# EAGLE design Rover_PCB_2019-02-01 (EAGLE 7.7.0)

## Sheet 1 of 10
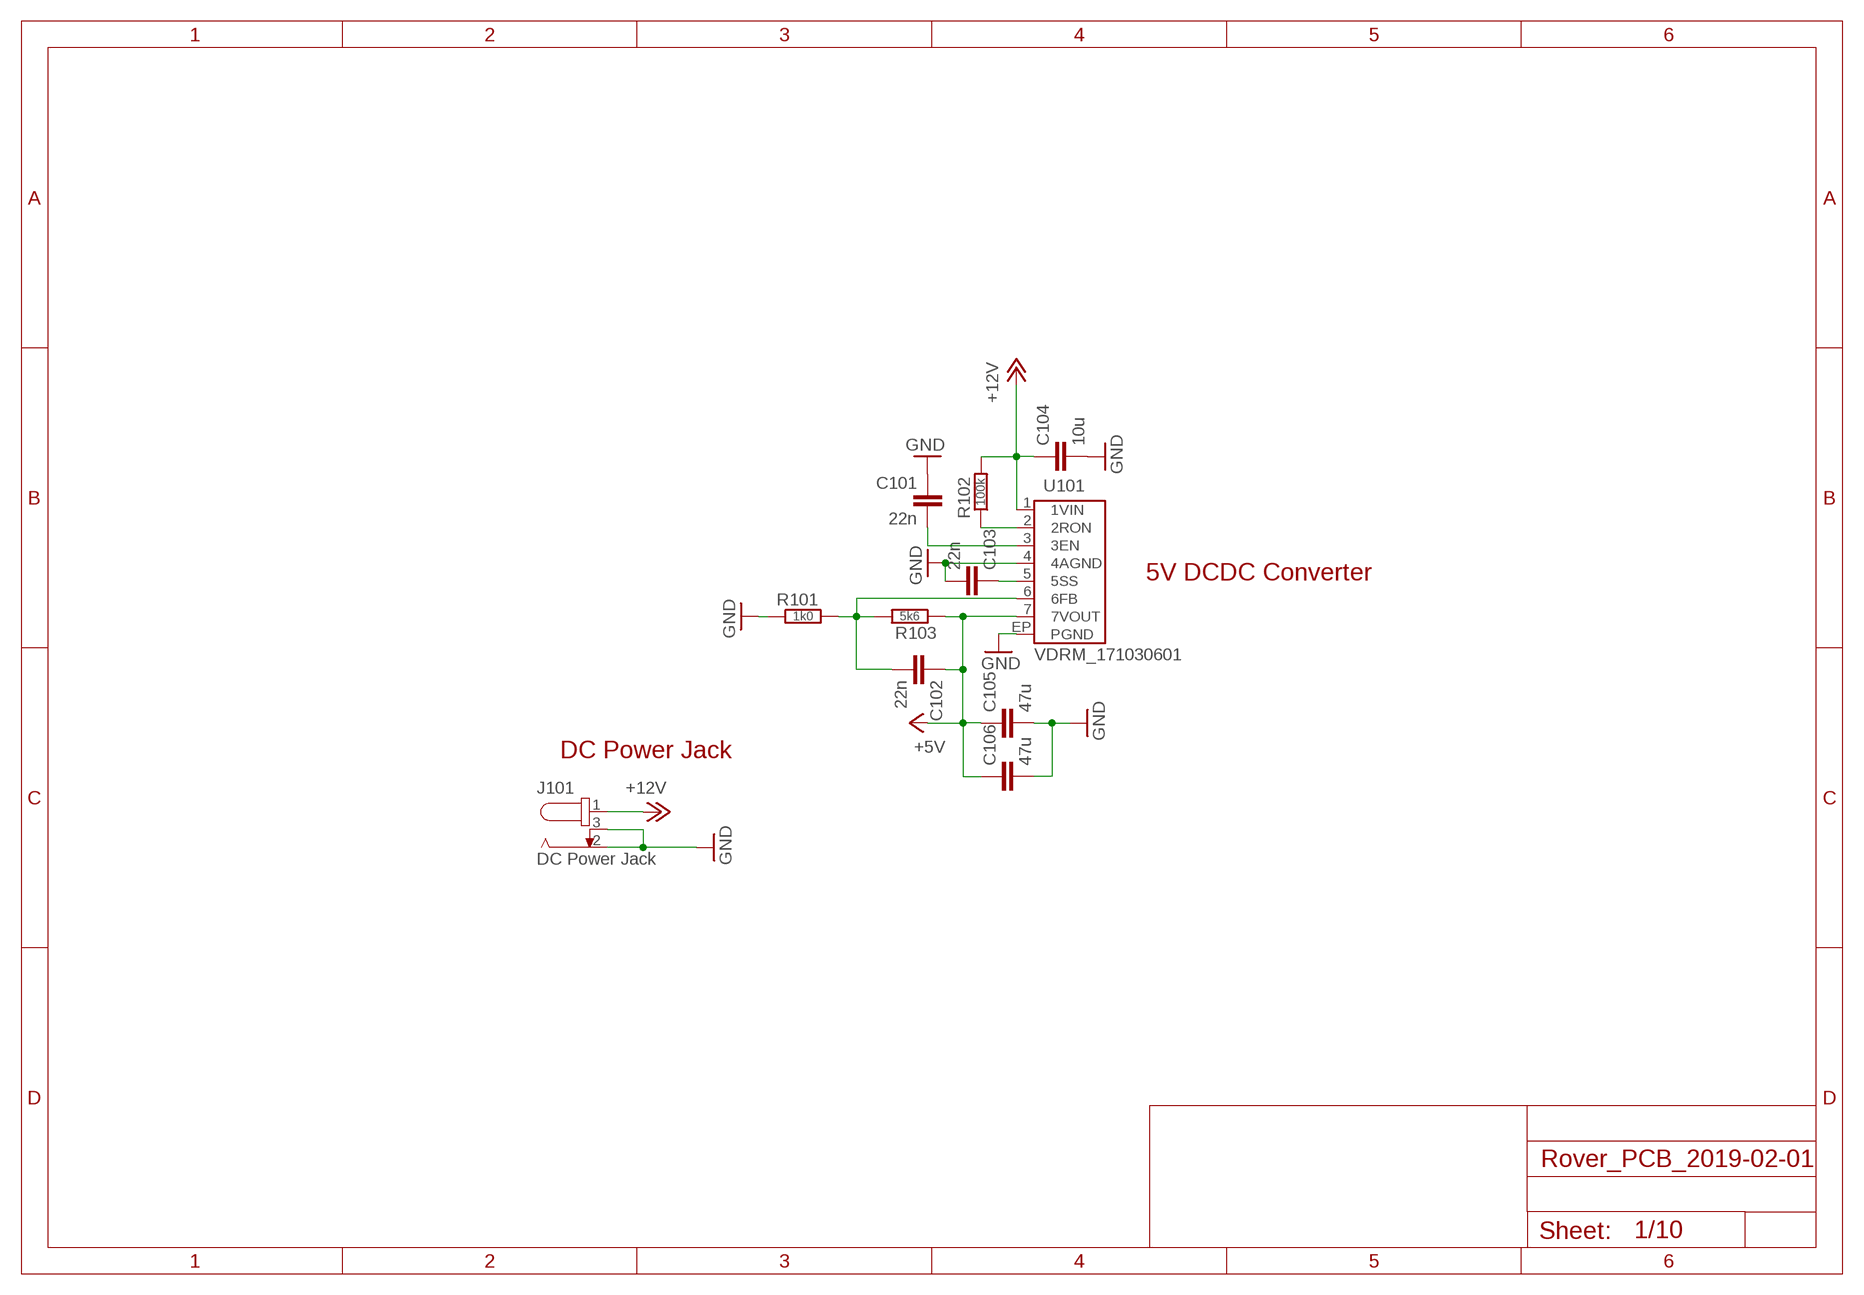
[diagram p0: schematic, sheet 1]

### Parts
C101  22n  C-EUC0805N  [CAPC2012X95N]
C102  22n  C-EUC0805N  [CAPC2012X95N]
C103  22n  C-EUC0805N  [CAPC2012X95N]
C104  10u  C-EUC1210N  [CAP-US1210-EU3225]
C105  47u  C-EUC1210N  [CAP-US1210-EU3225]
C106  47u  C-EUC1210N  [CAP-US1210-EU3225]
J101  DC Power Jack  694108105102  [69410X105102]
R101  1k0  R-EU-R0805N  [RESC2012X50N]
R102  100k  R-EU-R0805N  [RESC2012X50N]
R103  5k6  R-EU-R0805N  [RESC2012X50N]
U101  VDRM_171030601  [VDRM_7PIN-PFM]

### Nets
+5V: C102.1 C105.1 C106.1 R103.1 U101.7(7VOUT) ; also sheet 2,3,4,6
+12V: C104.1 J101.1 R102.2 U101.1(1VIN) ; also sheet 8,9
GND: C101.1 C103.2 C104.2 C105.2 C106.2 J101.2 J101.3 R101.1 U101.4(4AGND) U101.EP(PGND) ; also sheet 2,3,4,5,6,7,8,9,10
N$1: R102.1 U101.2(2RON)
N$2: C103.1 U101.5(5SS)
N$7: C102.2 R101.2 R103.2 U101.6(6FB)
N$9: C101.2 U101.3(3EN)

### Notes on the sheet
- 5V DCDC Converter
- DC Power Jack

## Sheet 2 of 10
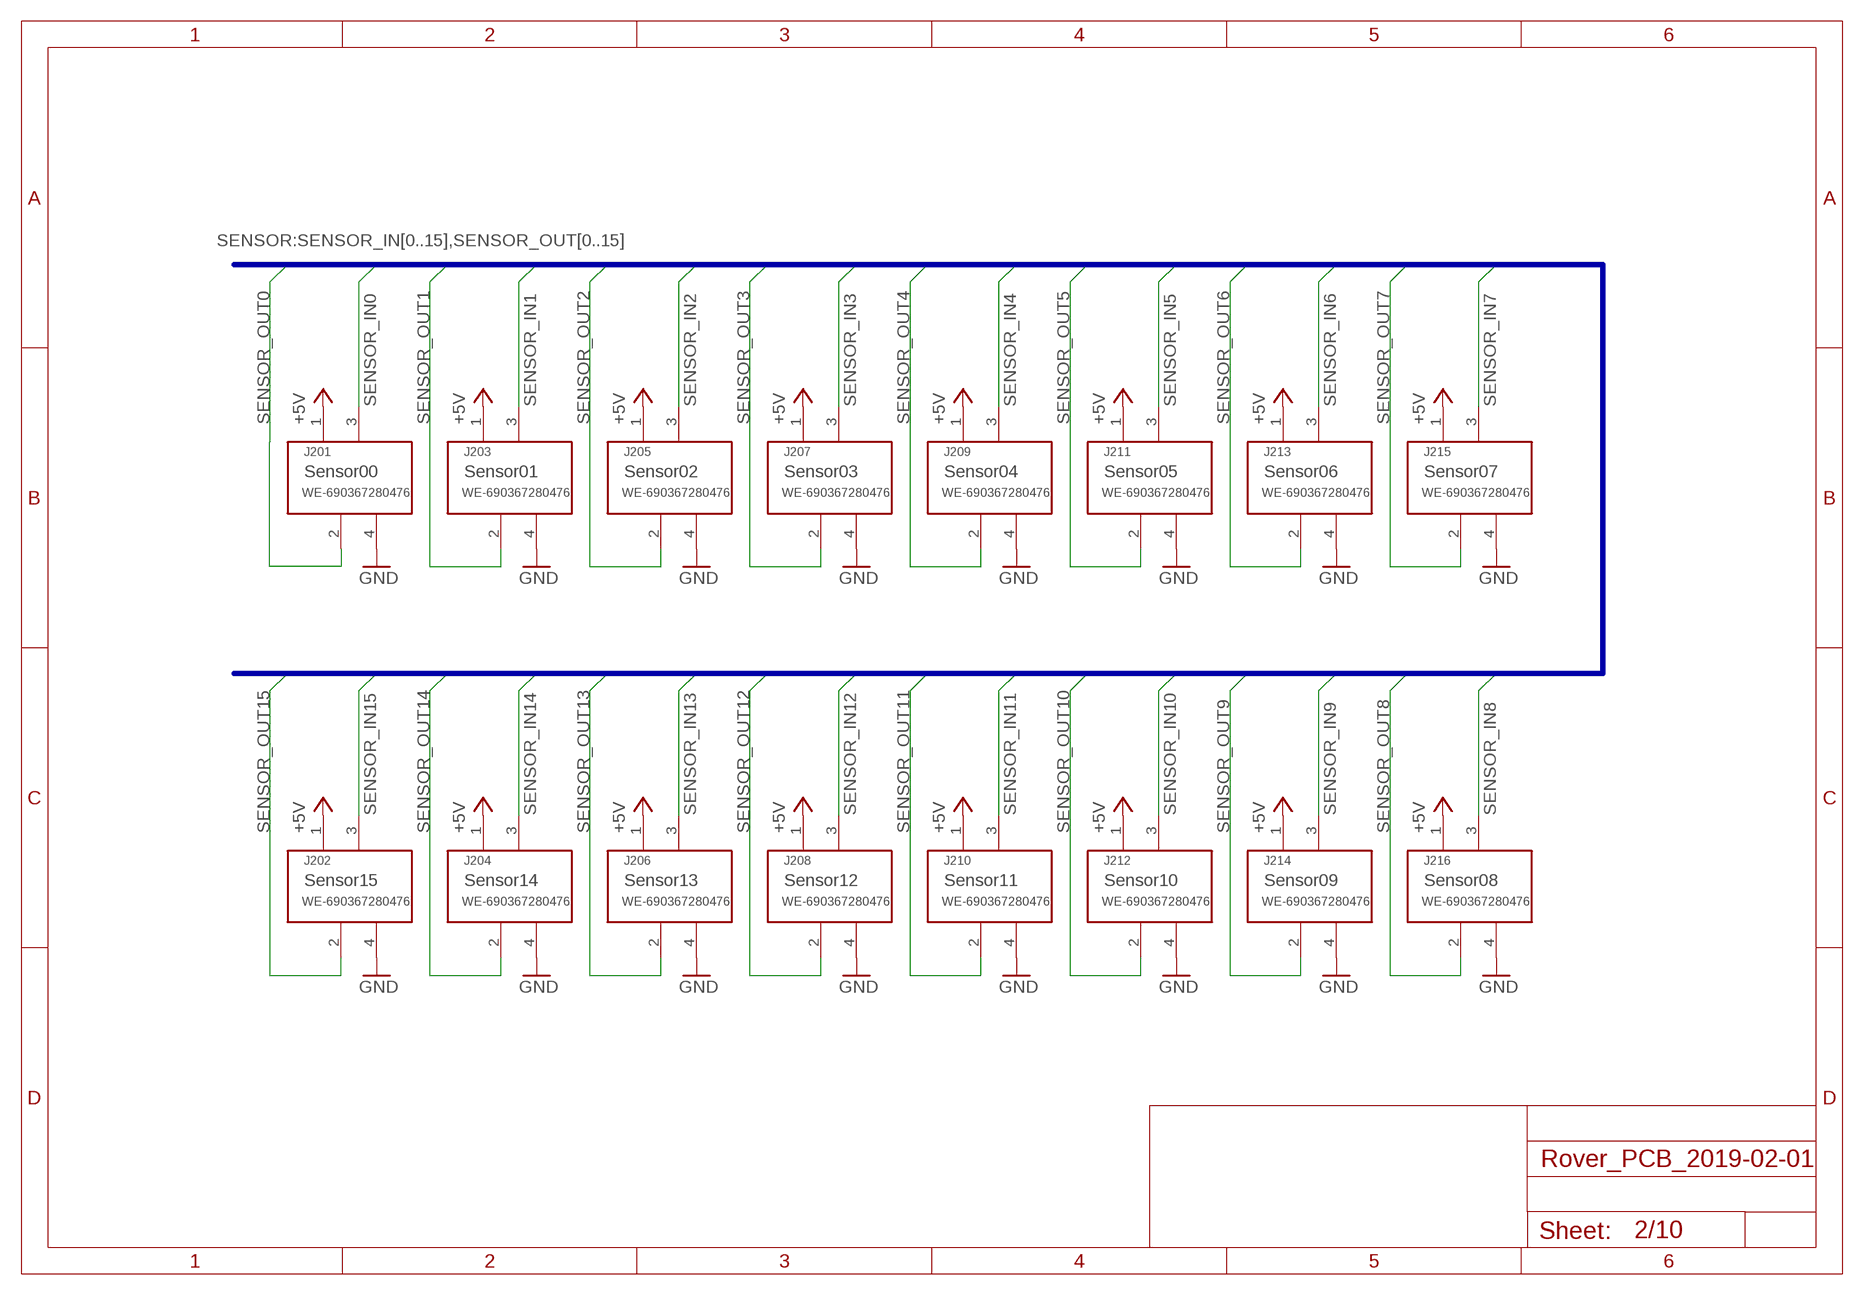
[diagram p1: schematic, sheet 2]

### Parts
J201  WE-690367280476  690367280476  [690367280476]
J202  WE-690367280476  690367280476  [690367280476]
J203  WE-690367280476  690367280476  [690367280476]
J204  WE-690367280476  690367280476  [690367280476]
J205  WE-690367280476  690367280476  [690367280476]
J206  WE-690367280476  690367280476  [690367280476]
J207  WE-690367280476  690367280476  [690367280476]
J208  WE-690367280476  690367280476  [690367280476]
J209  WE-690367280476  690367280476  [690367280476]
J210  WE-690367280476  690367280476  [690367280476]
J211  WE-690367280476  690367280476  [690367280476]
J212  WE-690367280476  690367280476  [690367280476]
J213  WE-690367280476  690367280476  [690367280476]
J214  WE-690367280476  690367280476  [690367280476]
J215  WE-690367280476  690367280476  [690367280476]
J216  WE-690367280476  690367280476  [690367280476]

### Nets
+5V: J201.1 J202.1 J203.1 J204.1 J205.1 J206.1 J207.1 J208.1 J209.1 J210.1 J211.1 J212.1 J213.1 J214.1 J215.1 J216.1 ; also sheet 1,3,4,6
GND: J201.4 J202.4 J203.4 J204.4 J205.4 J206.4 J207.4 J208.4 J209.4 J210.4 J211.4 J212.4 J213.4 J214.4 J215.4 J216.4 ; also sheet 1,3,4,5,6,7,8,9,10
SENSOR_IN0: J201.3 ; also sheet 3
SENSOR_IN1: J203.3 ; also sheet 3
SENSOR_IN2: J205.3 ; also sheet 3
SENSOR_IN3: J207.3 ; also sheet 3
SENSOR_IN4: J209.3 ; also sheet 3
SENSOR_IN5: J211.3 ; also sheet 3
SENSOR_IN6: J213.3 ; also sheet 3
SENSOR_IN7: J215.3 ; also sheet 3
SENSOR_IN8: J216.3 ; also sheet 3
SENSOR_IN9: J214.3 ; also sheet 3
SENSOR_IN10: J212.3 ; also sheet 3
SENSOR_IN11: J210.3 ; also sheet 3
SENSOR_IN12: J208.3 ; also sheet 3
SENSOR_IN13: J206.3 ; also sheet 3
SENSOR_IN14: J204.3 ; also sheet 3
SENSOR_IN15: J202.3 ; also sheet 3
SENSOR_OUT0: J201.2 ; also sheet 3
SENSOR_OUT1: J203.2 ; also sheet 3
SENSOR_OUT2: J205.2 ; also sheet 3
SENSOR_OUT3: J207.2 ; also sheet 3
SENSOR_OUT4: J209.2 ; also sheet 3
SENSOR_OUT5: J211.2 ; also sheet 3
SENSOR_OUT6: J213.2 ; also sheet 3
SENSOR_OUT7: J215.2 ; also sheet 3
SENSOR_OUT8: J216.2 ; also sheet 3
SENSOR_OUT9: J214.2 ; also sheet 3
SENSOR_OUT10: J212.2 ; also sheet 3
SENSOR_OUT11: J210.2 ; also sheet 3
SENSOR_OUT12: J208.2 ; also sheet 3
SENSOR_OUT13: J206.2 ; also sheet 3
SENSOR_OUT14: J204.2 ; also sheet 3
SENSOR_OUT15: J202.2 ; also sheet 3

### Buses
SENSOR:SENSOR_IN[0..15],SENSOR_OUT[0..15]

## Sheet 3 of 10
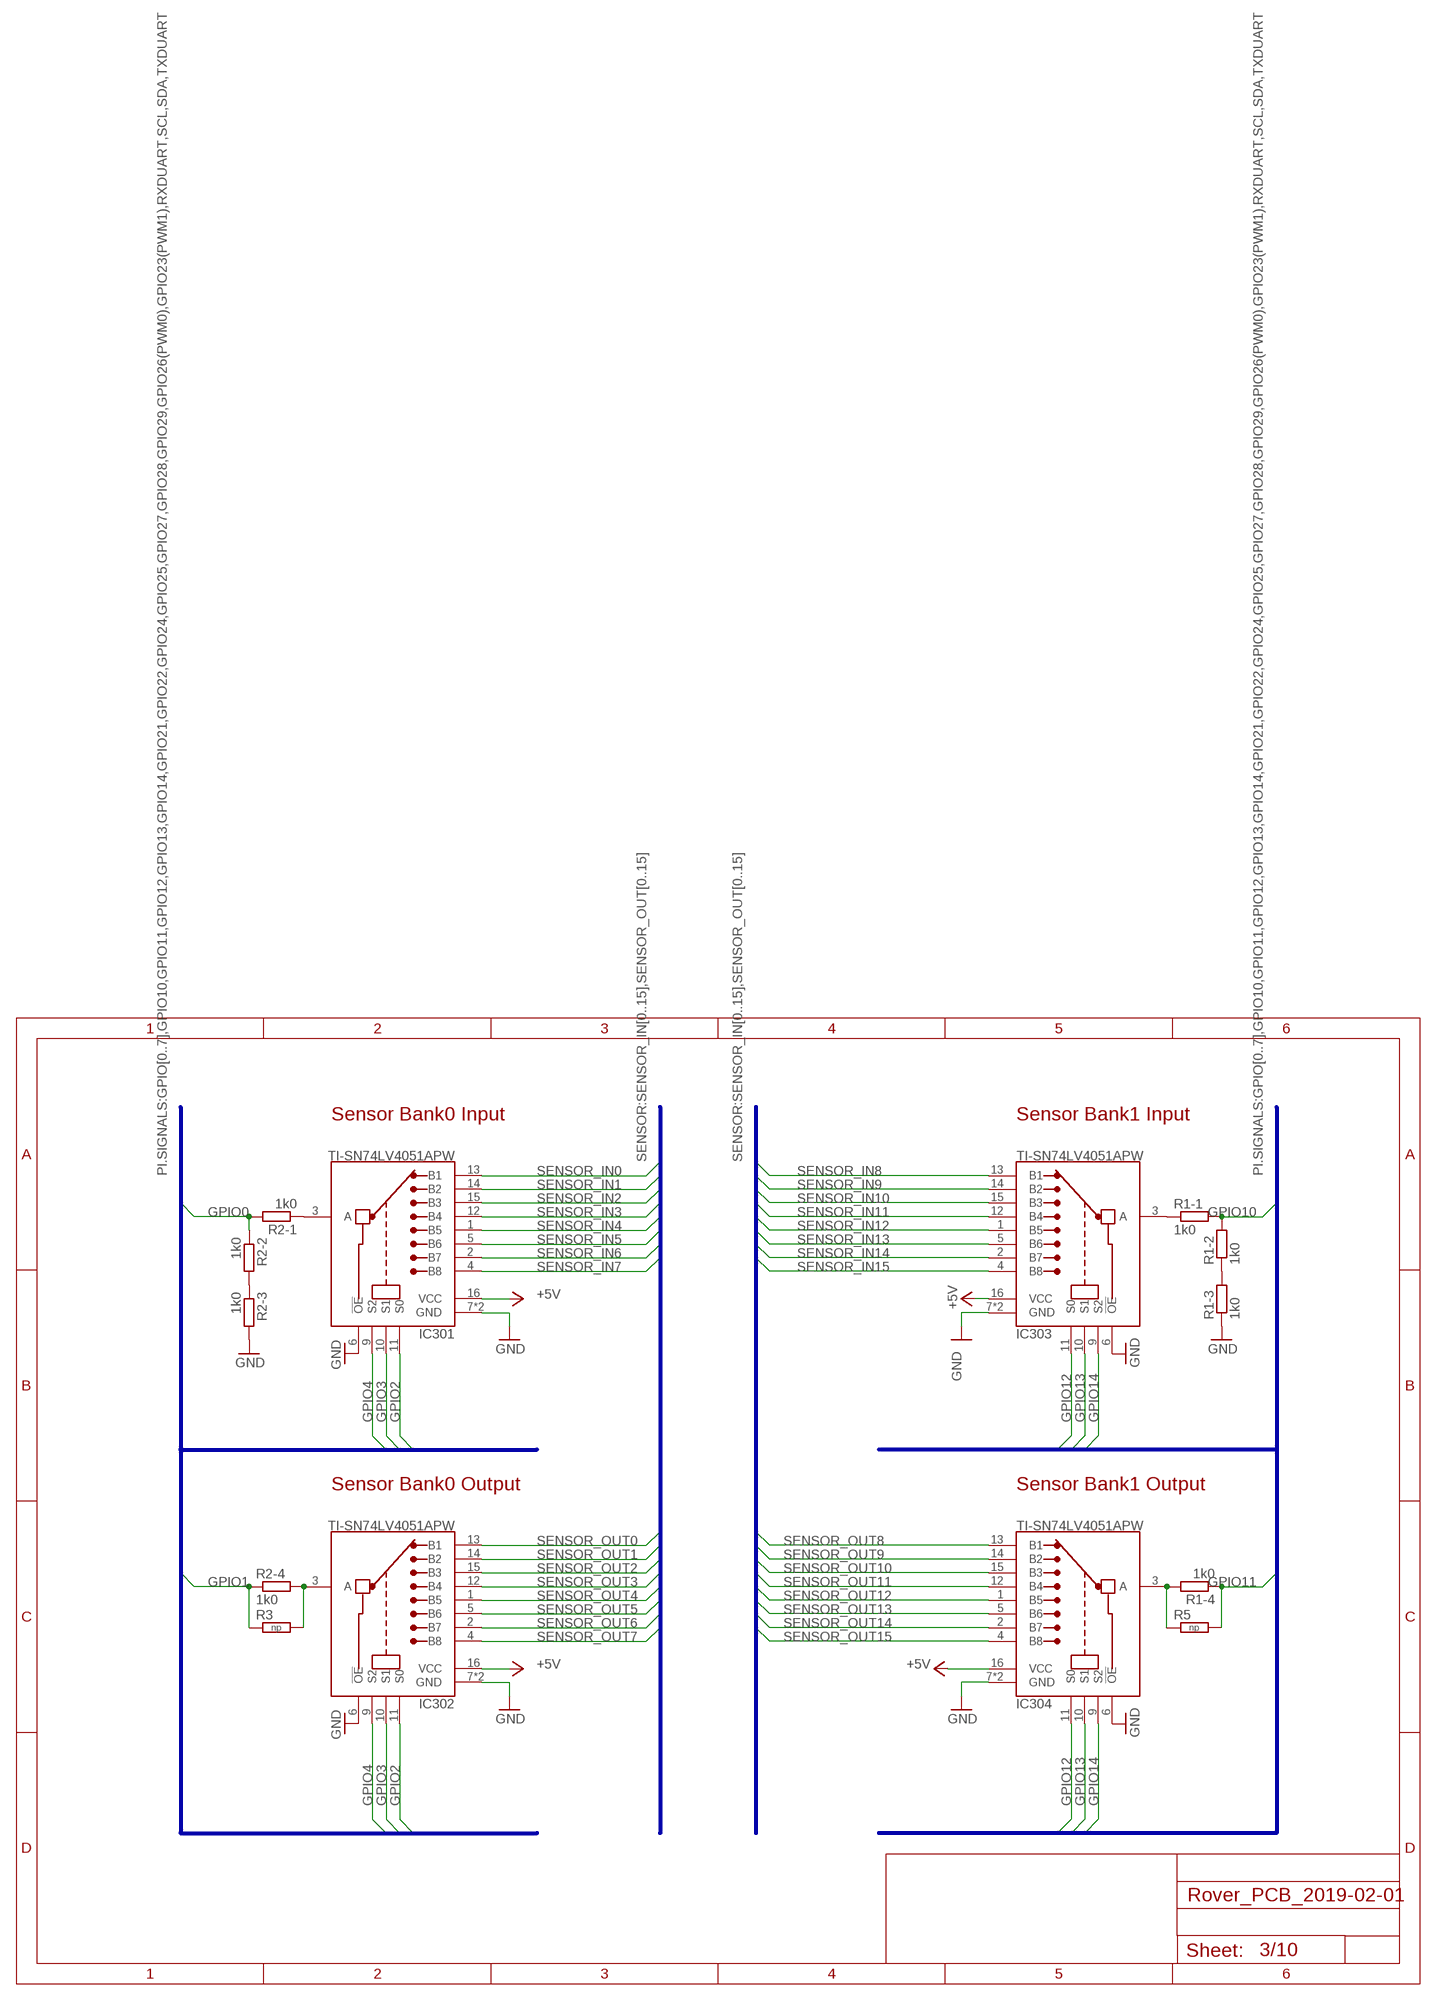
[diagram p2: schematic, sheet 3]

### Parts
IC301  TI-SN74LV4051APW  [SOP16P65_500X640X120L62X24L]
IC302  TI-SN74LV4051APW  [SOP16P65_500X640X120L62X24L]
IC303  TI-SN74LV4051APW  [SOP16P65_500X640X120L62X24L]
IC304  TI-SN74LV4051APW  [SOP16P65_500X640X120L62X24L]
R1  1k0  CTS-74,2C083  [CAPCAF80P160X320X70-8L]
R2  1k0  CTS-74,2C083  [CAPCAF80P160X320X70-8L]
R3  np  R-EU-R0805N  [RESC2012X50N]
R5  np  R-EU-R0805N  [RESC2012X50N]

### Nets
+5V: IC301.16(VCC) IC302.16(VCC) IC303.16(VCC) IC304.16(VCC) ; also sheet 1,2,4,6
GND: IC301.6(!OE) IC301.7(GND) IC301.8(GND) IC302.6(!OE) IC302.7(GND) IC302.8(GND) IC303.6(!OE) IC303.7(GND) IC303.8(GND) IC304.6(!OE) IC304.7(GND) IC304.8(GND) R1.3 R2.6 ; also sheet 1,2,4,5,6,7,8,9,10
GPIO0: R2.2 R2.8 ; also sheet 4
GPIO1: R2.4 R3.1 ; also sheet 4
GPIO2: IC301.11(S0) IC302.11(S0) ; also sheet 4
GPIO3: IC301.10(S1) IC302.10(S1) ; also sheet 4
GPIO4: IC301.9(S2) IC302.9(S2) ; also sheet 4
GPIO10: R1.7 R1.8 ; also sheet 4
GPIO11: R1.4 R5.2 ; also sheet 4
GPIO12: IC303.11(S0) IC304.11(S0) ; also sheet 4
GPIO13: IC303.10(S1) IC304.10(S1) ; also sheet 4
GPIO14: IC303.9(S2) IC304.9(S2) ; also sheet 4
N$8: R1.2 R1.6
N$75: IC302.3(A) R2.5 R3.2
N$76: IC304.3(A) R1.5 R5.1
N$79: R2.3 R2.7
N$80: IC301.3(A) R2.1
N$81: IC303.3(A) R1.1
SENSOR_IN0: IC301.13(B1) ; also sheet 2
SENSOR_IN1: IC301.14(B2) ; also sheet 2
SENSOR_IN2: IC301.15(B3) ; also sheet 2
SENSOR_IN3: IC301.12(B4) ; also sheet 2
SENSOR_IN4: IC301.1(B5) ; also sheet 2
SENSOR_IN5: IC301.5(B6) ; also sheet 2
SENSOR_IN6: IC301.2(B7) ; also sheet 2
SENSOR_IN7: IC301.4(B8) ; also sheet 2
SENSOR_IN8: IC303.13(B1) ; also sheet 2
SENSOR_IN9: IC303.14(B2) ; also sheet 2
SENSOR_IN10: IC303.15(B3) ; also sheet 2
SENSOR_IN11: IC303.12(B4) ; also sheet 2
SENSOR_IN12: IC303.1(B5) ; also sheet 2
SENSOR_IN13: IC303.5(B6) ; also sheet 2
SENSOR_IN14: IC303.2(B7) ; also sheet 2
SENSOR_IN15: IC303.4(B8) ; also sheet 2
SENSOR_OUT0: IC302.13(B1) ; also sheet 2
SENSOR_OUT1: IC302.14(B2) ; also sheet 2
SENSOR_OUT2: IC302.15(B3) ; also sheet 2
SENSOR_OUT3: IC302.12(B4) ; also sheet 2
SENSOR_OUT4: IC302.1(B5) ; also sheet 2
SENSOR_OUT5: IC302.5(B6) ; also sheet 2
SENSOR_OUT6: IC302.2(B7) ; also sheet 2
SENSOR_OUT7: IC302.4(B8) ; also sheet 2
SENSOR_OUT8: IC304.13(B1) ; also sheet 2
SENSOR_OUT9: IC304.14(B2) ; also sheet 2
SENSOR_OUT10: IC304.15(B3) ; also sheet 2
SENSOR_OUT11: IC304.12(B4) ; also sheet 2
SENSOR_OUT12: IC304.1(B5) ; also sheet 2
SENSOR_OUT13: IC304.5(B6) ; also sheet 2
SENSOR_OUT14: IC304.2(B7) ; also sheet 2
SENSOR_OUT15: IC304.4(B8) ; also sheet 2

### Buses
PI.SIGNALS:GPIO[0..7],GPIO10,GPIO11,GPIO12,GPIO13,GPIO14,GPIO21,GPIO22,GPIO24,GPIO25,GPIO27,GPIO28,GPIO29,GPIO26(PWM0),GPIO23(PWM1),RXDUART,SCL,SDA,TXDUART
SENSOR:SENSOR_IN[0..15],SENSOR_OUT[0..15]

### Notes on the sheet
- Sensor Bank0 Input | Sensor Bank1 Input
- Sensor Bank0 Output | Sensor Bank1 Output

## Sheet 4 of 10
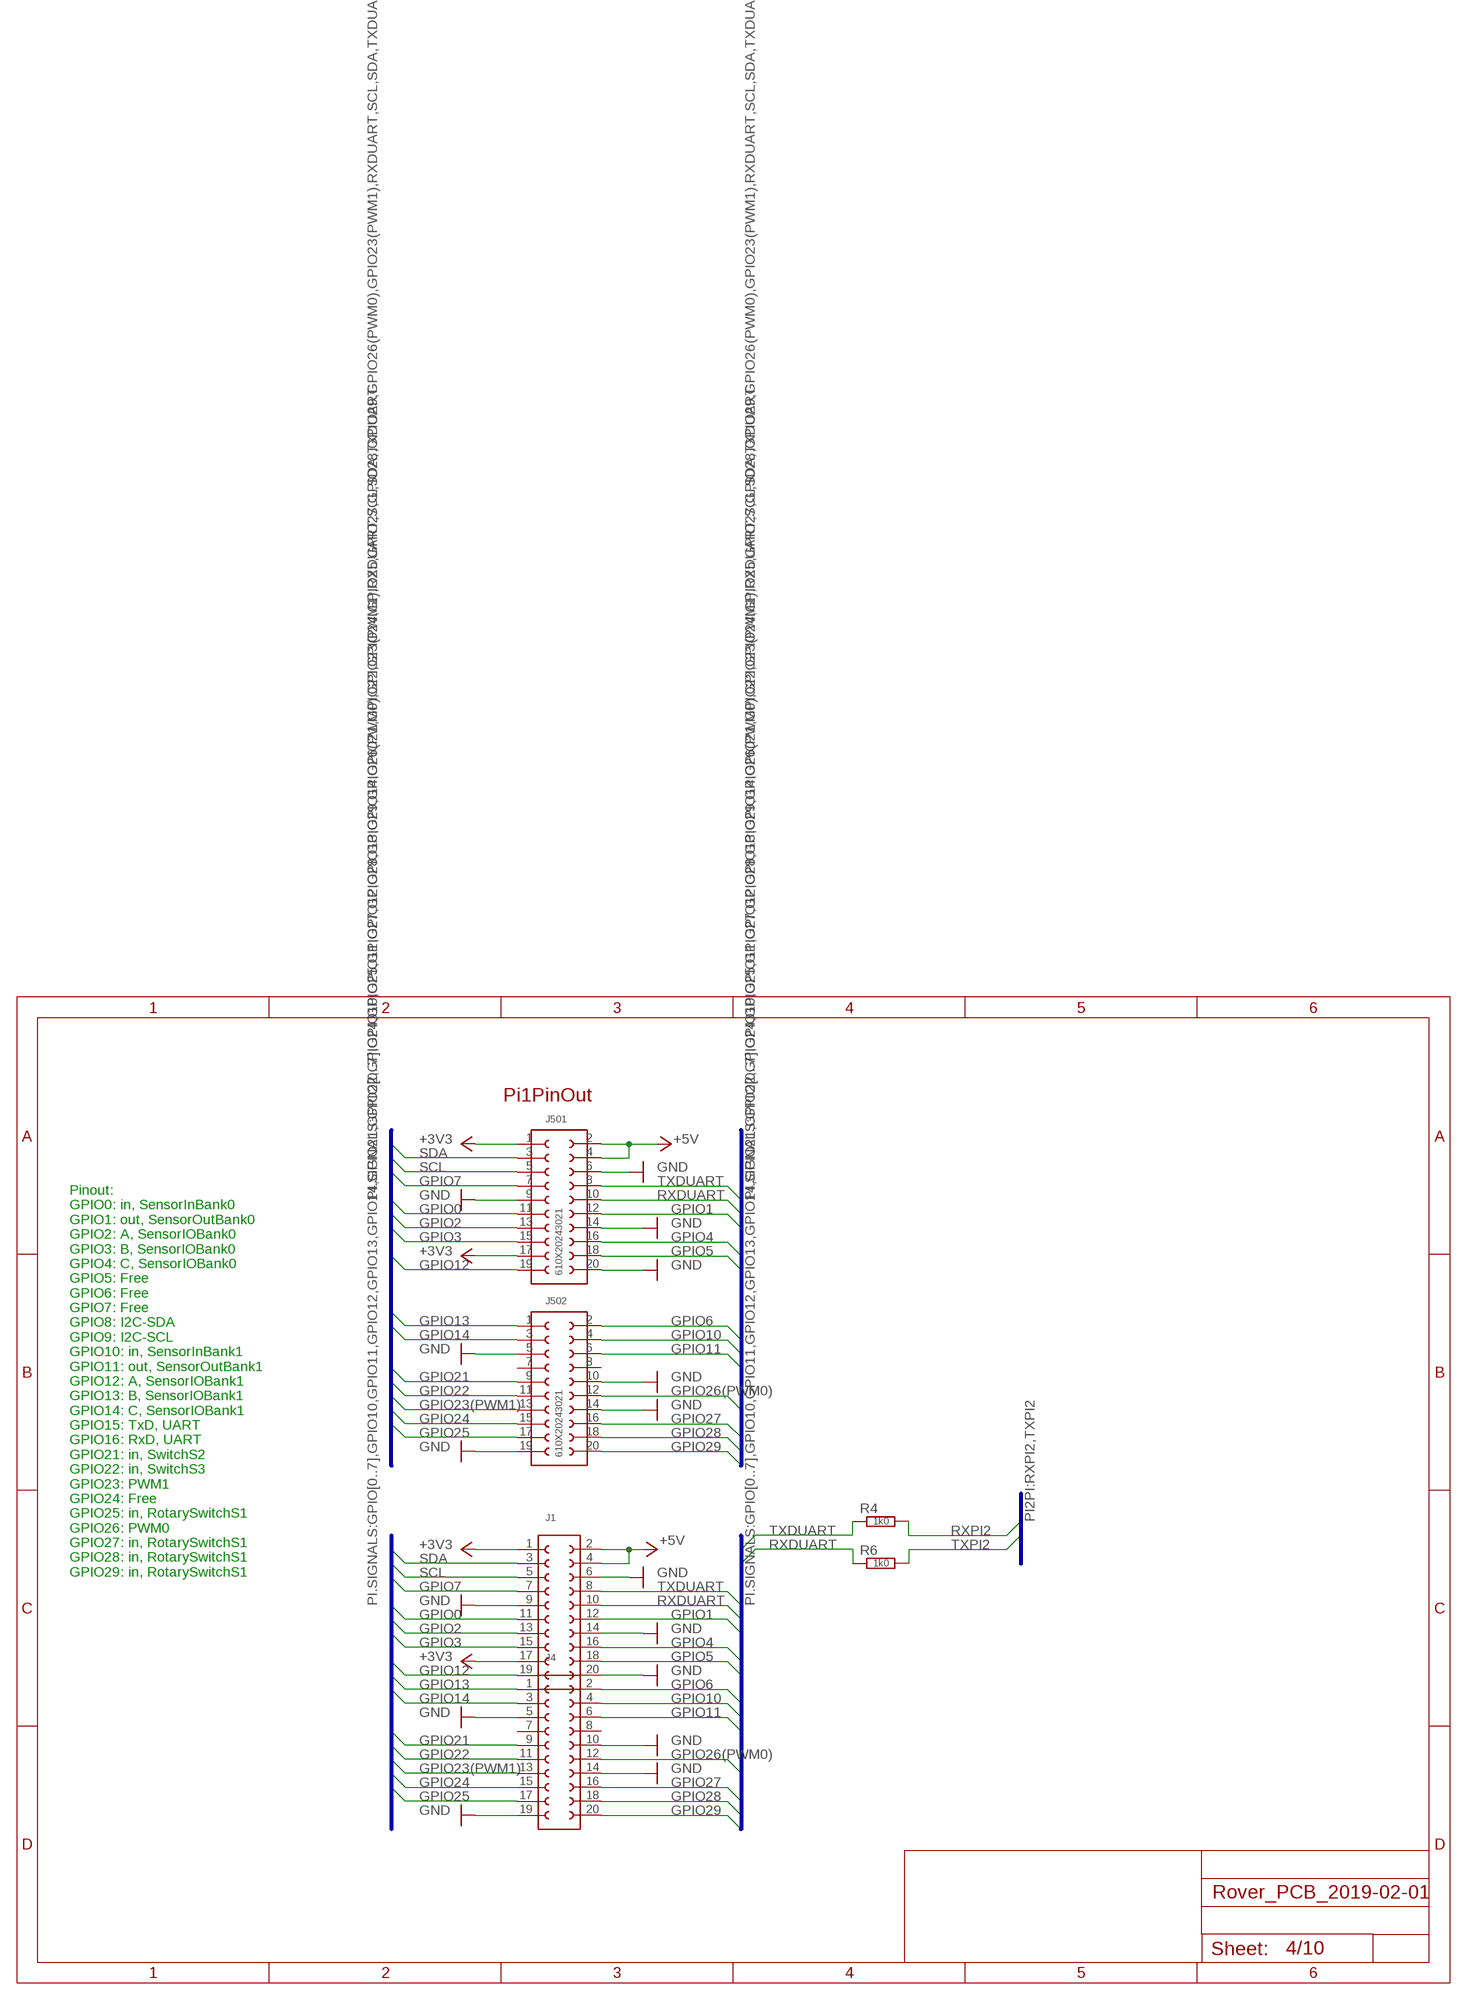
[diagram p3: schematic, sheet 4]

### Parts
J1  610X2021121  [610X2021121]
J4  610X2021121  [610X2021121]
J501  610X20243021  [610X20243021]
J502  610X20243021  [610X20243021]
R4  1k0  R-EU-R0805N  [RESC2012X50N]
R6  1k0  R-EU-R0805N  [RESC2012X50N]

### Nets
+3V3: J1.1 J1.17 J501.1 J501.17 ; also sheet 5,7,8,9,10
+5V: J1.2 J1.4 J501.2 J501.4 ; also sheet 1,2,3,6
GND: J1.6 J1.9 J1.14 J1.20 J4.5 J4.10 J4.14 J4.19 J501.6 J501.9 J501.14 J501.20 J502.5 J502.10 J502.14 J502.19 ; also sheet 1,2,3,5,6,7,8,9,10
GPIO0: J1.11 J501.11 ; also sheet 3
GPIO1: J1.12 J501.12 ; also sheet 3
GPIO2: J1.13 J501.13 ; also sheet 3
GPIO3: J1.15 J501.15 ; also sheet 3
GPIO4: J1.16 J501.16 ; also sheet 3
GPIO5: J1.18 J501.18
GPIO6: J4.2 J502.2
GPIO7: J1.7 J501.7
GPIO10: J4.4 J502.4 ; also sheet 3
GPIO11: J4.6 J502.6 ; also sheet 3
GPIO12: J1.19 J501.19 ; also sheet 3
GPIO13: J4.1 J502.1 ; also sheet 3
GPIO14: J4.3 J502.3 ; also sheet 3
GPIO21: J4.9 J502.9 ; also sheet 10
GPIO22: J4.11 J502.11 ; also sheet 10
GPIO23(PWM1): J4.13 J502.13 ; also sheet 7
GPIO24: J4.15 J502.15
GPIO25: J4.17 J502.17 ; also sheet 10
GPIO26(PWM0): J4.12 J502.12 ; also sheet 7
GPIO27: J4.16 J502.16 ; also sheet 10
GPIO28: J4.18 J502.18 ; also sheet 10
GPIO29: J4.20 J502.20 ; also sheet 10
RXDUART: J1.10 J501.10 R6.1
RXPI2: R4.2 ; also sheet 6
SCL: J1.5 J501.5 ; also sheet 5,7
SDA: J1.3 J501.3 ; also sheet 5,7
TXDUART: J1.8 J501.8 R4.1
TXPI2: R6.2 ; also sheet 6
Unconnected: J4.7 J4.8 J502.7 J502.8

### Buses
PI.SIGNALS:GPIO[0..7],GPIO10,GPIO11,GPIO12,GPIO13,GPIO14,GPIO21,GPIO22,GPIO24,GPIO25,GPIO27,GPIO28,GPIO29,GPIO26(PWM0),GPIO23(PWM1),RXDUART,SCL,SDA,TXDUART
PI2PI:RXPI2,TXPI2

### Notes on the sheet
- Pi1PinOut
- Pinout:
  GPIO0: in, SensorInBank0
  GPIO1: out, SensorOutBank0
  GPIO2: A, SensorIOBank0
  GPIO3: B, SensorIOBank0
  GPIO4: C, SensorIOBank0
  GPIO5: Free
  GPIO6: Free
  GPIO7: Free
  GPIO8: I2C-SDA
  GPIO9: I2C-SCL
  GPIO10: in, SensorInBank1
  GPIO11: out, SensorOutBank1
  GPIO12: A, SensorIOBank1
  GPIO13: B, SensorIOBank1
  GPIO14: C, SensorIOBank1
  GPIO15: TxD, UART
  GPIO16: RxD, UART
  GPIO21: in, SwitchS2
  GPIO22: in, SwitchS3
  GPIO23: PWM1
  GPIO24: Free
  GPIO25: in, RotarySwitchS1
  GPIO26: PWM0
  GPIO27: in, RotarySwitchS1
  GPIO28: in, RotarySwitchS1
  GPIO29: in, RotarySwitchS1

## Sheet 5 of 10
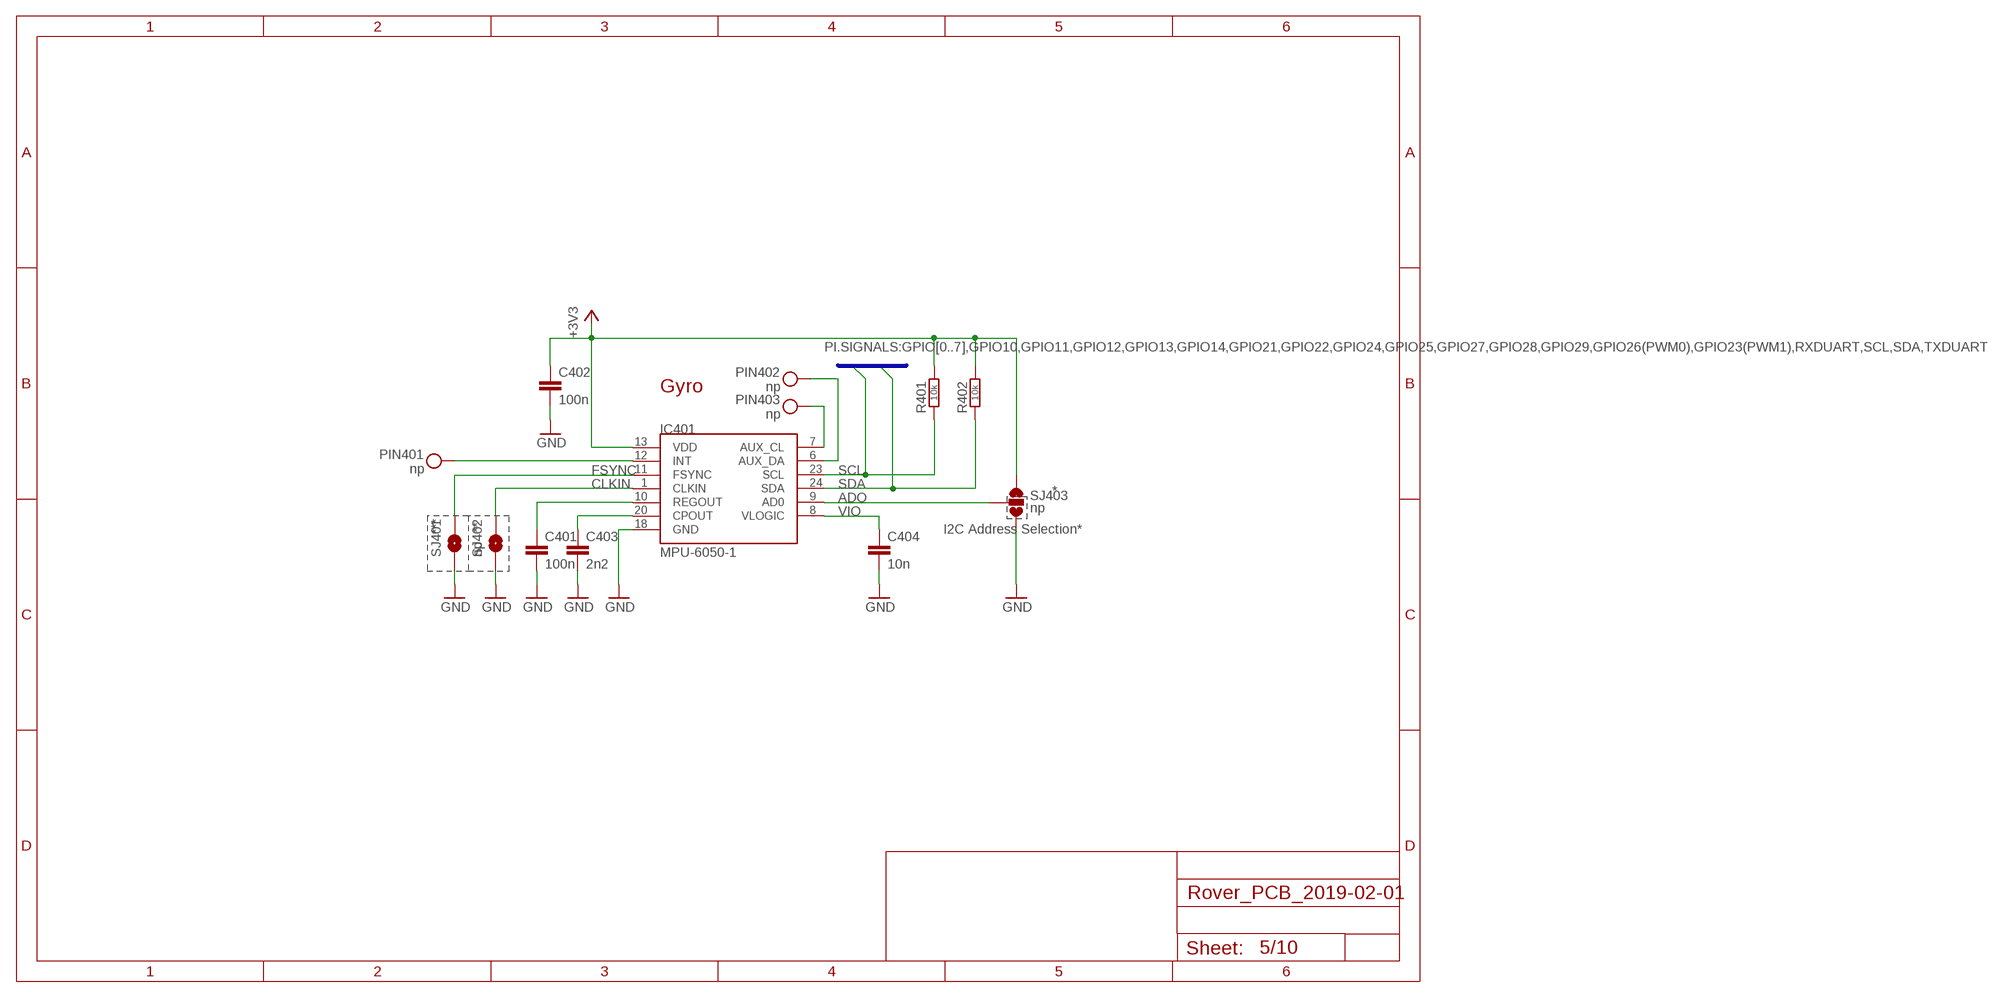
[diagram p4: schematic, sheet 5]

### Parts
C401  100n  C-EUC0805N  [CAPC2012X95N]
C402  100n  C-EUC0805N  [CAPC2012X95N]
C403  2n2  C-EUC0805N  [CAPC2012X95N]
C404  10n  C-EUC0805N  [CAPC2012X95N]
IC401  MPU-6050-1  [QFN-24-4MM2]
PIN401  np  SOLDER_PIN-0.5  [SOLDER_PIN_0.5]
PIN402  np  SOLDER_PIN-0.5  [SOLDER_PIN_0.5]
PIN403  np  SOLDER_PIN-0.5  [SOLDER_PIN_0.5]
R401  10k  R-EU-R0805N  [RESC2012X50N]
R402  10k  R-EU-R0805N  [RESC2012X50N]
SJ401  np  SOLDERJUMPERTRACE  [SJ_2S-TRACE]
SJ402  np  SOLDERJUMPERTRACE  [SJ_2S-TRACE]
SJ403  np  SOLDERJUMPER_2WAYPASTE1&2  [SJ_3_PASTE1&2]

### Nets
+3V3: C402.1 IC401.13(VDD) R401.2 R402.2 SJ403.1 ; also sheet 4,7,8,9,10
ADO: IC401.9(AD0) SJ403.2
CLKIN: IC401.1(CLKIN) SJ402.2
FSYNC: IC401.11(FSYNC) SJ401.2
GND: C401.2 C402.2 C403.2 C404.2 IC401.18(GND) SJ401.1 SJ402.1 SJ403.3 ; also sheet 1,2,3,4,6,7,8,9,10
INT: IC401.12(INT) PIN401._(PIN)
N$3: C403.1 IC401.20(CPOUT)
N$4: IC401.6(AUX_DA) PIN402._(PIN)
N$5: C401.1 IC401.10(REGOUT)
N$6: IC401.7(AUX_CL) PIN403._(PIN)
SCL: IC401.23(SCL) R401.1 ; also sheet 4,7
SDA: IC401.24(SDA) R402.1 ; also sheet 4,7
VIO: C404.1 IC401.8(VLOGIC)

### Buses
PI.SIGNALS:GPIO[0..7],GPIO10,GPIO11,GPIO12,GPIO13,GPIO14,GPIO21,GPIO22,GPIO24,GPIO25,GPIO27,GPIO28,GPIO29,GPIO26(PWM0),GPIO23(PWM1),RXDUART,SCL,SDA,TXDUART

### Notes on the sheet
- Gyro
- *
- *** | ** | I2C Address Selection*

## Sheet 6 of 10
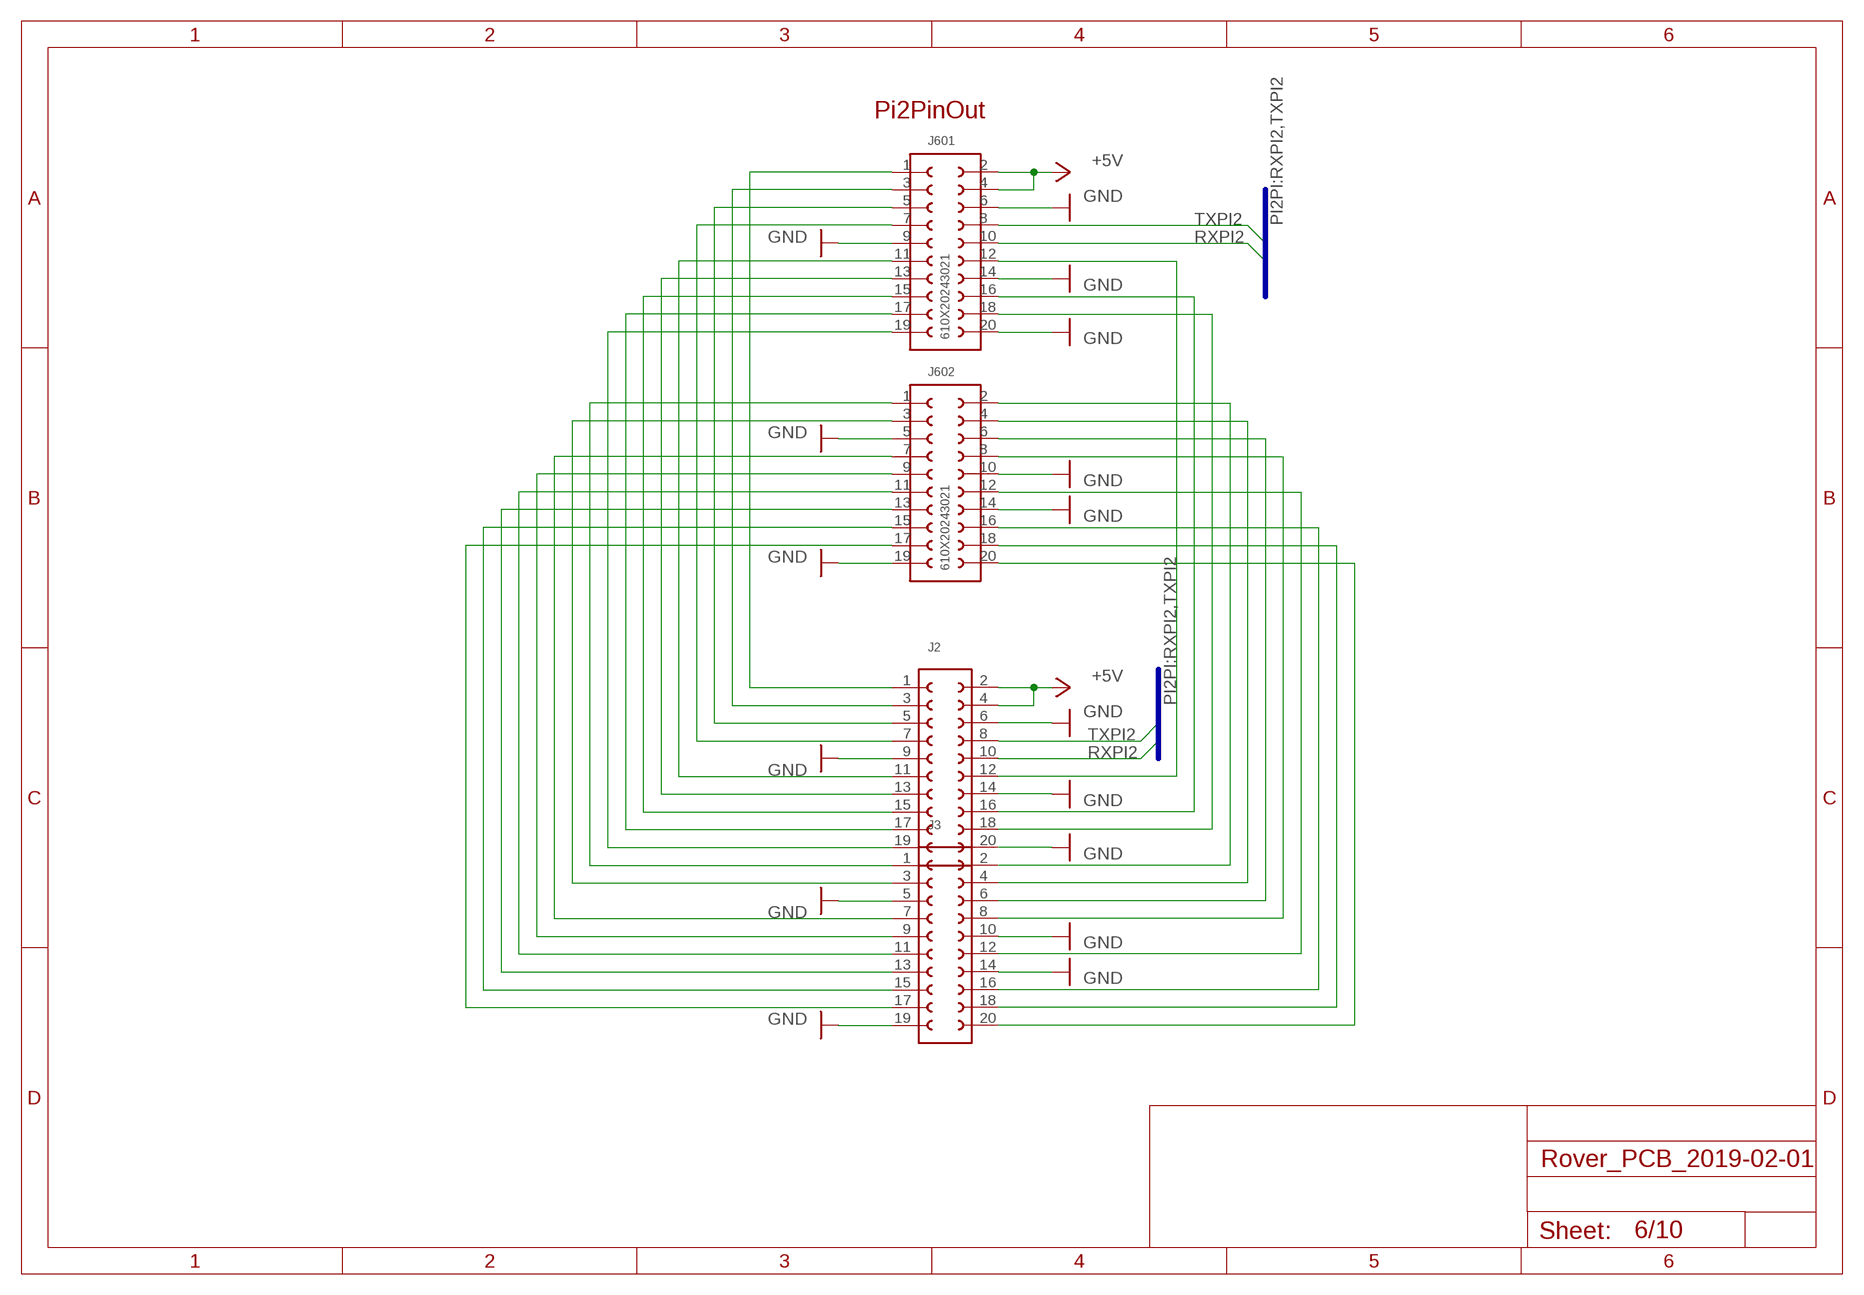
[diagram p5: schematic, sheet 6]

### Parts
J2  610X2021121  [610X2021121]
J3  610X2021121  [610X2021121]
J601  610X20243021  [610X20243021]
J602  610X20243021  [610X20243021]

### Nets
+5V: J2.2 J2.4 J601.2 J601.4 ; also sheet 1,2,3,4
GND: J2.6 J2.9 J2.14 J2.20 J3.5 J3.10 J3.14 J3.19 J601.6 J601.9 J601.14 J601.20 J602.5 J602.10 J602.14 J602.19 ; also sheet 1,2,3,4,5,7,8,9,10
N$47: J3.11 J602.11
N$48: J3.13 J602.13
N$49: J3.15 J602.15
N$50: J3.17 J602.17
N$51: J2.16 J601.16
N$52: J2.12 J601.12
N$53: J2.18 J601.18
N$54: J3.2 J602.2
N$55: J3.4 J602.4
N$56: J3.6 J602.6
N$57: J3.8 J602.8
N$58: J3.12 J602.12
N$59: J2.3 J601.3
N$60: J2.5 J601.5
N$61: J2.7 J601.7
N$62: J2.11 J601.11
N$63: J2.13 J601.13
N$64: J2.15 J601.15
N$65: J2.1 J601.1
N$66: J2.19 J601.19
N$67: J3.1 J602.1
N$68: J3.3 J602.3
N$69: J3.7 J602.7
N$70: J3.9 J602.9
N$71: J3.16 J602.16
N$72: J3.18 J602.18
N$73: J3.20 J602.20
N$74: J2.17 J601.17
RXPI2: J2.10 J601.10 ; also sheet 4
TXPI2: J2.8 J601.8 ; also sheet 4

### Buses
PI2PI:RXPI2,TXPI2

### Notes on the sheet
- Pi2PinOut

## Sheet 7 of 10
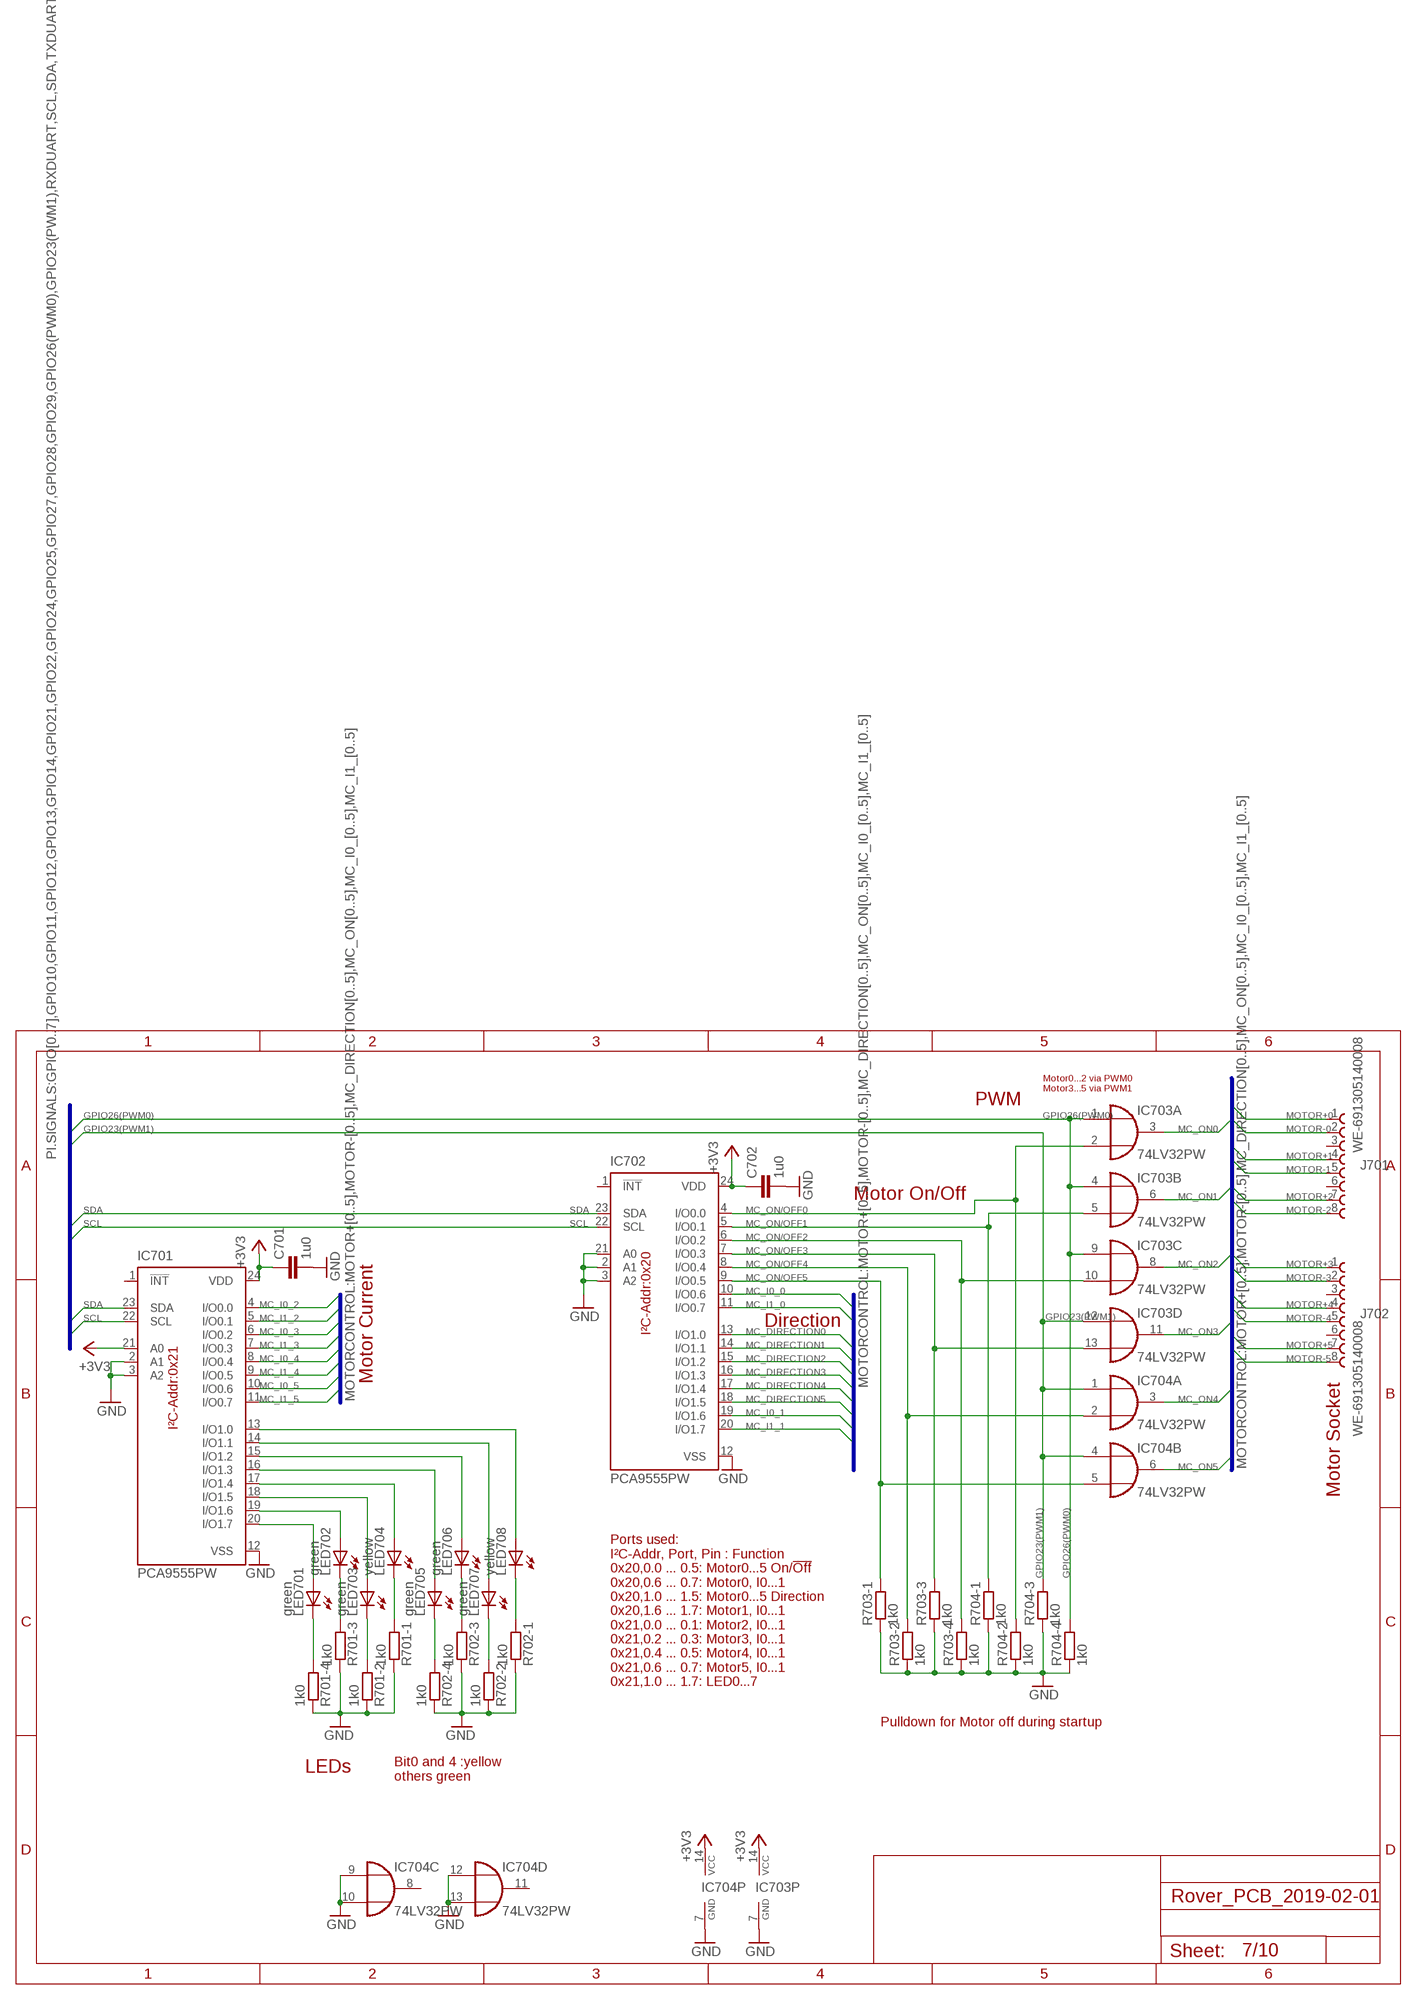
[diagram p6: schematic, sheet 7]

### Parts
C701  1u0  C-EUC0805N  [CAPC2012X95N]
C702  1u0  C-EUC0805N  [CAPC2012X95N]
IC701  PCA9555PW  [TSSOP24]
IC702  PCA9555PW  [TSSOP24]
IC703  74LV32PW  [SOP14P65_500X640X120L62X24L]
IC704  74LV32PW  [SOP14P65_500X640X120L62X24L]
J701  WE-691305140008  691305140008  [691305140008]
J702  WE-691305140008  691305140008  [691305140008]
LED701  green  LED0603  [LED-0603]
LED702  green  LED0603  [LED-0603]
LED703  green  LED0603  [LED-0603]
LED704  yellow  LED0603  [LED-0603]
LED705  green  LED0603  [LED-0603]
LED706  green  LED0603  [LED-0603]
LED707  green  LED0603  [LED-0603]
LED708  yellow  LED0603  [LED-0603]
R701  1k0  CTS-74,2C083  [CAPCAF80P160X320X70-8L]
R702  1k0  CTS-74,2C083  [CAPCAF80P160X320X70-8L]
R703  1k0  CTS-74,2C083  [CAPCAF80P160X320X70-8L]
R704  1k0  CTS-74,2C083  [CAPCAF80P160X320X70-8L]

### Nets
+3V3: C701.1 C702.1 IC701.21(A0) IC701.24(VDD) IC702.24(VDD) IC703.14(P:VCC) IC704.14(P:VCC) ; also sheet 4,5,8,9,10
GND: C701.2 C702.2 IC701.2(A1) IC701.3(A2) IC701.12(VSS) IC702.2(A1) IC702.3(A2) IC702.12(VSS) IC702.21(A0) IC703.7(P:GND) IC704.7(P:GND) IC704.9(C:I0) IC704.10(C:I1) IC704.12(D:I0) IC704.13(D:I1) R701.1 R701.2 R701.3 R701.4 R702.1 R702.2 R702.3 R702.4 R703.1 R703.2 R703.3 R703.4 R704.1 R704.2 R704.3 R704.4 ; also sheet 1,2,3,4,5,6,8,9,10
GPIO23(PWM1): IC703.12(D:I0) IC704.1(A:I0) IC704.4(B:I0) R704.6 ; also sheet 4
GPIO26(PWM0): IC703.1(A:I0) IC703.4(B:I0) IC703.9(C:I0) R704.5 ; also sheet 4
MC_DIRECTION0: IC702.13(I/O1.0) ; also sheet 8
MC_DIRECTION1: IC702.14(I/O1.1) ; also sheet 8
MC_DIRECTION2: IC702.15(I/O1.2) ; also sheet 8
MC_DIRECTION3: IC702.16(I/O1.3) ; also sheet 8
MC_DIRECTION4: IC702.17(I/O1.4) ; also sheet 9
MC_DIRECTION5: IC702.18(I/O1.5) ; also sheet 9
MC_I0_0: IC702.10(I/O0.6) ; also sheet 8
MC_I0_1: IC702.19(I/O1.6) ; also sheet 8
MC_I0_2: IC701.4(I/O0.0) ; also sheet 8
MC_I0_3: IC701.6(I/O0.2) ; also sheet 8
MC_I0_4: IC701.8(I/O0.4) ; also sheet 9
MC_I0_5: IC701.10(I/O0.6) ; also sheet 9
MC_I1_0: IC702.11(I/O0.7) ; also sheet 8
MC_I1_1: IC702.20(I/O1.7) ; also sheet 8
MC_I1_2: IC701.5(I/O0.1) ; also sheet 8
MC_I1_3: IC701.7(I/O0.3) ; also sheet 8
MC_I1_4: IC701.9(I/O0.5) ; also sheet 9
MC_I1_5: IC701.11(I/O0.7) ; also sheet 9
MC_ON0: IC703.3(A:O) ; also sheet 8
MC_ON1: IC703.6(B:O) ; also sheet 8
MC_ON2: IC703.8(C:O) ; also sheet 8
MC_ON3: IC703.11(D:O) ; also sheet 8
MC_ON4: IC704.3(A:O) ; also sheet 9
MC_ON5: IC704.6(B:O) ; also sheet 9
MC_ON/OFF0: IC702.4(I/O0.0) IC703.2(A:I1) R704.7
MC_ON/OFF1: IC702.5(I/O0.1) IC703.5(B:I1) R704.8
MC_ON/OFF2: IC702.6(I/O0.2) IC703.10(C:I1) R703.5
MC_ON/OFF3: IC702.7(I/O0.3) IC703.13(D:I1) R703.6
MC_ON/OFF4: IC702.8(I/O0.4) IC704.2(A:I1) R703.7
MC_ON/OFF5: IC702.9(I/O0.5) IC704.5(B:I1) R703.8
MOTOR+0: J701.1 ; also sheet 8
MOTOR+1: J701.4 ; also sheet 8
MOTOR+2: J701.7 ; also sheet 8
MOTOR+3: J702.1 ; also sheet 8
MOTOR+4: J702.4 ; also sheet 9
MOTOR+5: J702.7 ; also sheet 9
MOTOR-0: J701.2 ; also sheet 8
MOTOR-1: J701.5 ; also sheet 8
MOTOR-2: J701.8 ; also sheet 8
MOTOR-3: J702.2 ; also sheet 8
MOTOR-4: J702.5 ; also sheet 9
MOTOR-5: J702.8 ; also sheet 9
N$22: LED708.C R702.8
N$23: LED707.C R702.7
N$24: LED706.C R702.6
N$25: LED705.C R702.5
N$26: LED704.C R701.8
N$27: LED703.C R701.7
N$28: LED702.C R701.6
N$29: LED701.C R701.5
N$30: IC701.13(I/O1.0) LED708.A
N$31: IC701.14(I/O1.1) LED707.A
N$32: IC701.15(I/O1.2) LED706.A
N$33: IC701.16(I/O1.3) LED705.A
N$34: IC701.17(I/O1.4) LED704.A
N$35: IC701.18(I/O1.5) LED703.A
N$36: IC701.19(I/O1.6) LED702.A
N$37: IC701.20(I/O1.7) LED701.A
SCL: IC701.22(SCL) IC702.22(SCL) ; also sheet 4,5
SDA: IC701.23(SDA) IC702.23(SDA) ; also sheet 4,5
Unconnected: IC701.1(!INT) IC702.1(!INT) IC704.8(C:O) IC704.11(D:O) J701.3 J701.6 J702.3 J702.6

### Buses
MOTORCONTROL:MOTOR+[0..5],MOTOR-[0..5],MC_DIRECTION[0..5],MC_ON[0..5],MC_I0_[0..5],MC_I1_[0..5]
PI.SIGNALS:GPIO[0..7],GPIO10,GPIO11,GPIO12,GPIO13,GPIO14,GPIO21,GPIO22,GPIO24,GPIO25,GPIO27,GPIO28,GPIO29,GPIO26(PWM0),GPIO23(PWM1),RXDUART,SCL,SDA,TXDUART

### Notes on the sheet
- Motor0...2 via PWM0
  Motor3...5 via PWM1
- PWM
- Motor On/Off
- Direction
- I²C-Addr:0x20
- Motor Current
- I²C-Addr:0x21
- Motor Socket
- Ports used:
  I²C-Addr, Port, Pin : Function
  0x20,0.0 ... 0.5: Motor0...5 On/!Off!
  0x20,0.6 ... 0.7: Motor0, I0...1
  0x20,1.0 ... 1.5: Motor0...5 Direction
  0x20,1.6 ... 1.7: Motor1, I0...1
  0x21,0.0 ... 0.1: Motor2, I0...1
  0x21,0.2 ... 0.3: Motor3, I0...1
  0x21,0.4 ... 0.5: Motor4, I0...1
  0x21,0.6 ... 0.7: Motor5, I0...1
  0x21,1.0 ... 1.7: LED0...7
- Pulldown for Motor off during startup
- LEDs
- Bit0 and 4 :yellow
  others green

## Sheet 8 of 10
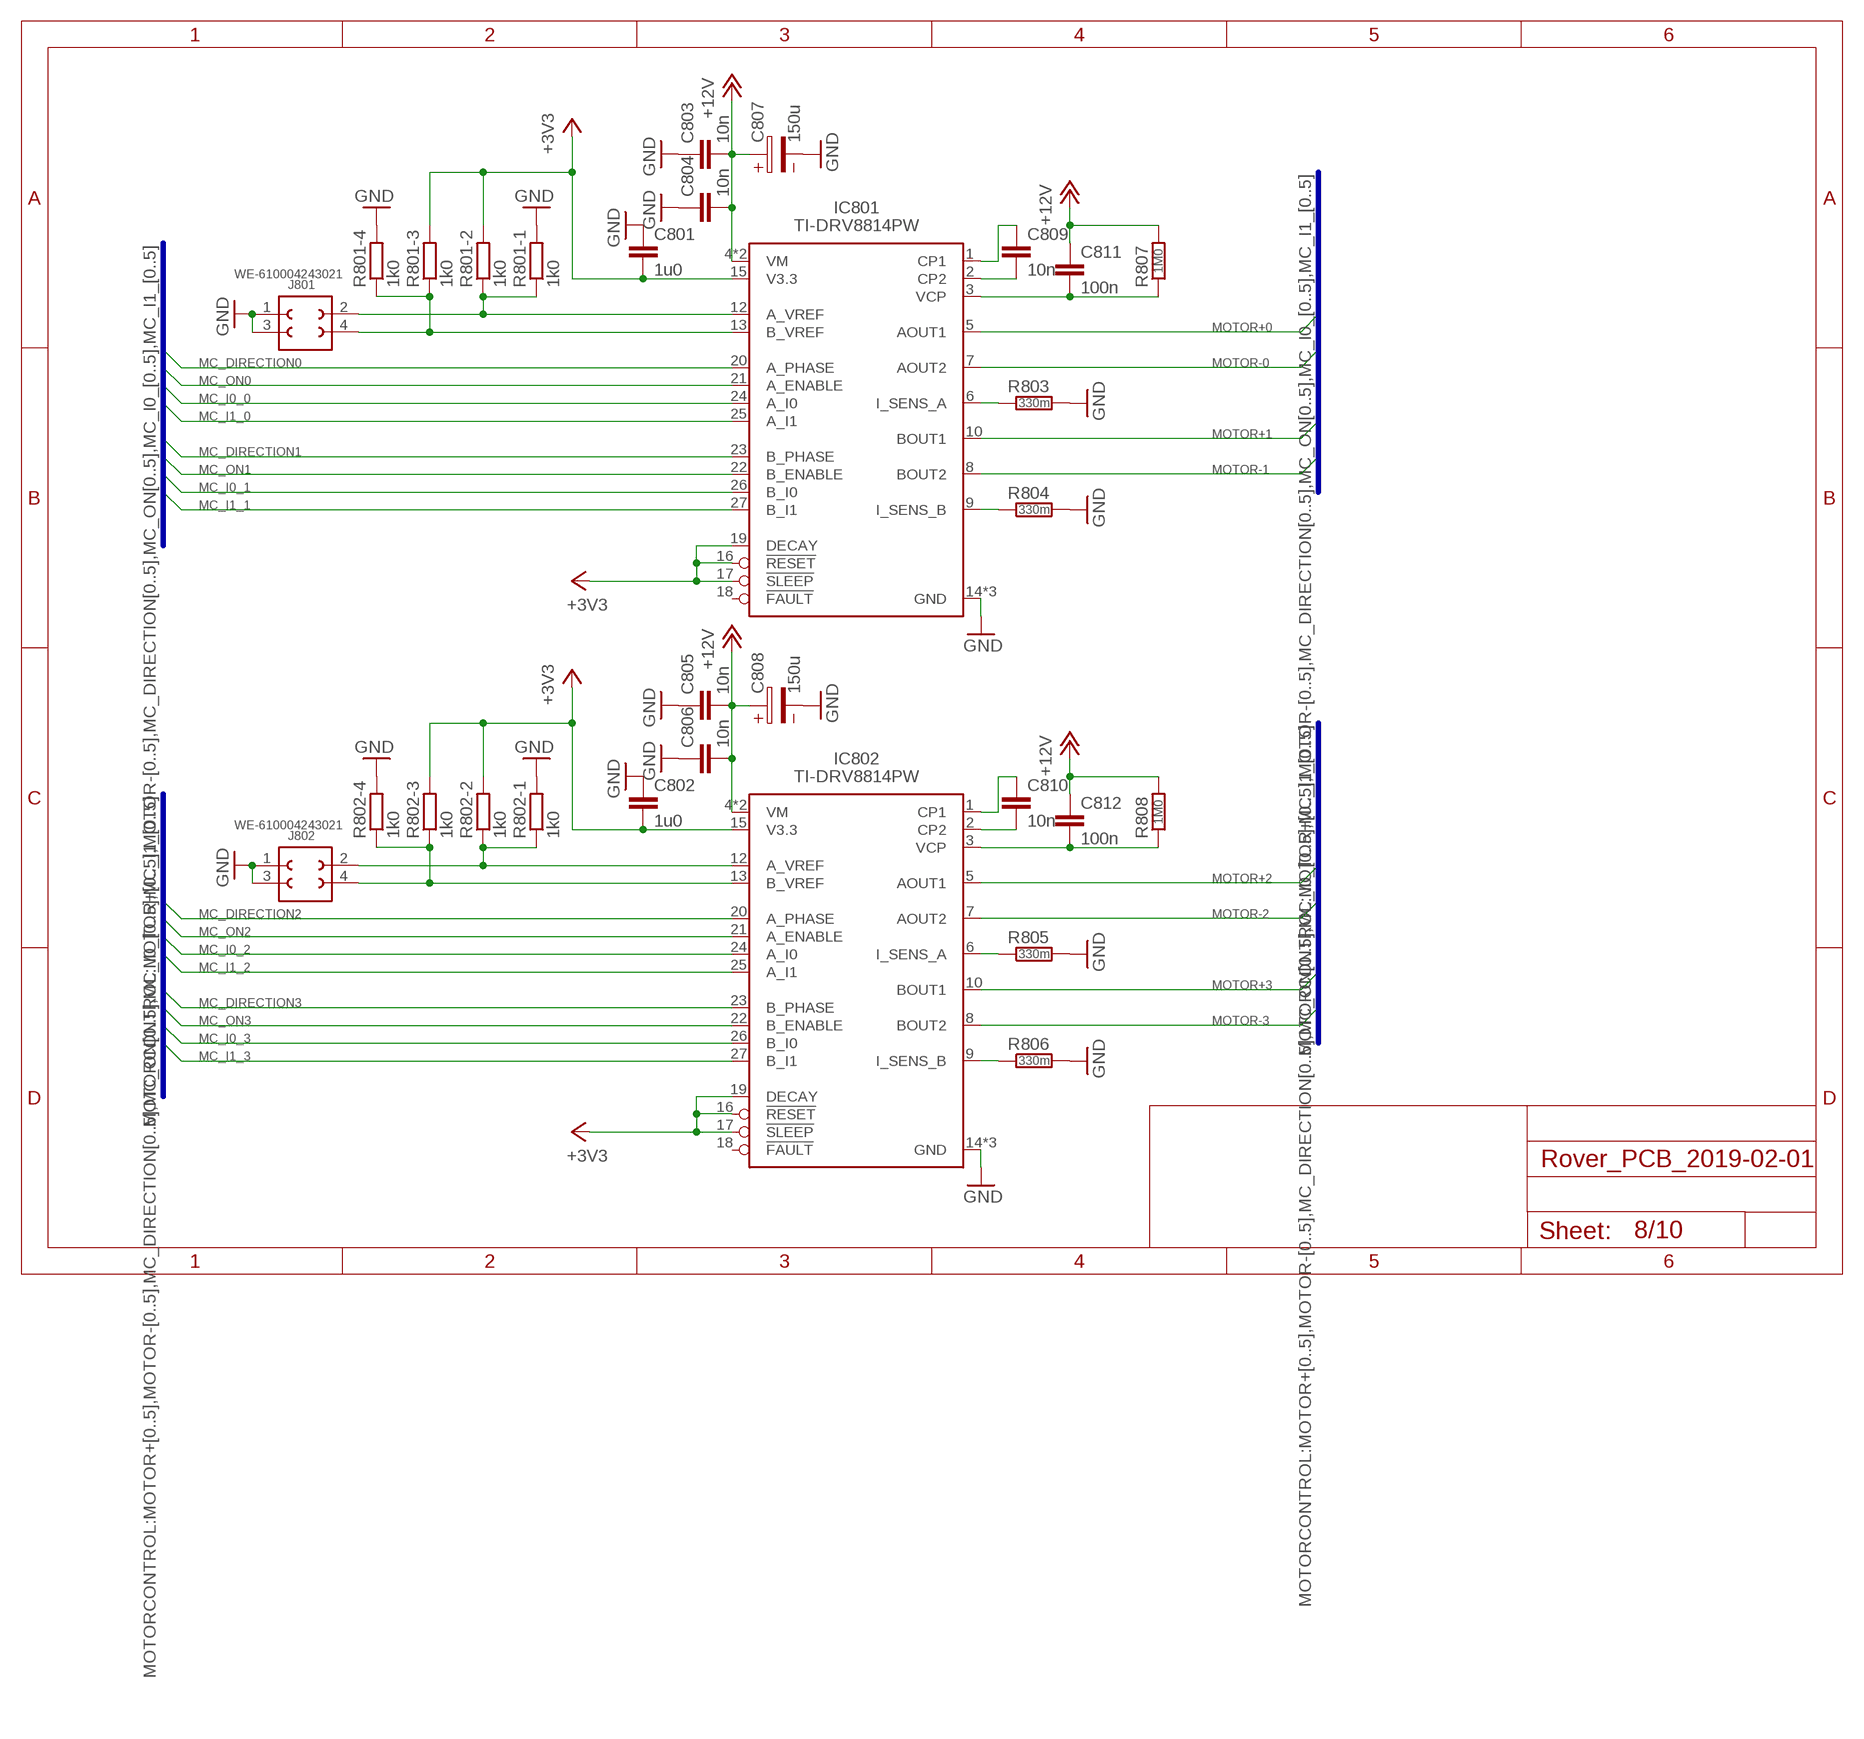
[diagram p7: schematic, sheet 8]

### Parts
C801  1u0  C-EUC0805N  [CAPC2012X95N]
C802  1u0  C-EUC0805N  [CAPC2012X95N]
C803  10n  C-EUC0805N  [CAPC2012X95N]
C804  10n  C-EUC0805N  [CAPC2012X95N]
C805  10n  C-EUC0805N  [CAPC2012X95N]
C806  10n  C-EUC0805N  [CAPC2012X95N]
C807  150u  WCAP-PSHP_8X8,7_875115452004  [4.2X1.9X2.8(BXCXA)]
C808  150u  WCAP-PSHP_8X8,7_875115452004  [4.2X1.9X2.8(BXCXA)]
C809  10n  C-EUC0805N  [CAPC2012X95N]
C810  10n  C-EUC0805N  [CAPC2012X95N]
C811  100n  C-EUC0805N  [CAPC2012X95N]
C812  100n  C-EUC0805N  [CAPC2012X95N]
IC801  TI-DRV8814PW  [SOP29P65_970X640X120L60X24T500X270N]
IC802  TI-DRV8814PW  [SOP29P65_970X640X120L60X24T500X270N]
J801  WE-610004243021  610X04243021  [610X04243021]
J802  WE-610004243021  610X04243021  [610X04243021]
R801  1k0  CTS-74,2C083  [CAPCAF80P160X320X70-8L]
R802  1k0  CTS-74,2C083  [CAPCAF80P160X320X70-8L]
R803  330m  R-EU-R0612L  [RESC160X320X65L50L]
R804  330m  R-EU-R0612L  [RESC160X320X65L50L]
R805  330m  R-EU-R0612L  [RESC160X320X65L50L]
R806  330m  R-EU-R0612L  [RESC160X320X65L50L]
R807  1M0  R-EU-R0805N  [RESC2012X50N]
R808  1M0  R-EU-R0805N  [RESC2012X50N]

### Nets
+3V3: C801.2 C802.2 IC801.15(V3.3) IC801.16(!RESET) IC801.17(!SLEEP) IC801.19(DECAY) IC802.15(V3.3) IC802.16(!RESET) IC802.17(!SLEEP) IC802.19(DECAY) R801.6 R801.7 R802.6 R802.7 ; also sheet 4,5,7,9,10
+12V: C803.2 C804.2 C805.2 C806.2 C807.1 C808.1 C811.1 C812.1 IC801.4(VM) IC801.11(VM) IC802.4(VM) IC802.11(VM) R807.2 R808.2 ; also sheet 1,9
GND: C801.1 C802.1 C803.1 C804.1 C805.1 C806.1 C807.2 C808.2 IC801.14(GND) IC801.28(GND) IC801.29(GND) IC802.14(GND) IC802.28(GND) IC802.29(GND) J801.1 J801.3 J802.1 J802.3 R801.5 R801.8 R802.5 R802.8 R803.2 R804.2 R805.2 R806.2 ; also sheet 1,2,3,4,5,6,7,9,10
MC_DIRECTION0: IC801.20(A_PHASE) ; also sheet 7
MC_DIRECTION1: IC801.23(B_PHASE) ; also sheet 7
MC_DIRECTION2: IC802.20(A_PHASE) ; also sheet 7
MC_DIRECTION3: IC802.23(B_PHASE) ; also sheet 7
MC_I0_0: IC801.24(A_I0) ; also sheet 7
MC_I0_1: IC801.26(B_I0) ; also sheet 7
MC_I0_2: IC802.24(A_I0) ; also sheet 7
MC_I0_3: IC802.26(B_I0) ; also sheet 7
MC_I1_0: IC801.25(A_I1) ; also sheet 7
MC_I1_1: IC801.27(B_I1) ; also sheet 7
MC_I1_2: IC802.25(A_I1) ; also sheet 7
MC_I1_3: IC802.27(B_I1) ; also sheet 7
MC_ON0: IC801.21(A_ENABLE) ; also sheet 7
MC_ON1: IC801.22(B_ENABLE) ; also sheet 7
MC_ON2: IC802.21(A_ENABLE) ; also sheet 7
MC_ON3: IC802.22(B_ENABLE) ; also sheet 7
MOTOR+0: IC801.5(AOUT1) ; also sheet 7
MOTOR+1: IC801.10(BOUT1) ; also sheet 7
MOTOR+2: IC802.5(AOUT1) ; also sheet 7
MOTOR+3: IC802.10(BOUT1) ; also sheet 7
MOTOR-0: IC801.7(AOUT2) ; also sheet 7
MOTOR-1: IC801.8(BOUT2) ; also sheet 7
MOTOR-2: IC802.7(AOUT2) ; also sheet 7
MOTOR-3: IC802.8(BOUT2) ; also sheet 7
N$10: C811.2 IC801.3(VCP) R807.1
N$11: C809.2 IC801.2(CP2)
N$12: C809.1 IC801.1(CP1)
N$13: IC801.6(I_SENS_A) R803.1
N$14: IC801.9(I_SENS_B) R804.1
N$15: IC801.13(B_VREF) J801.4 R801.3 R801.4
N$16: IC801.12(A_VREF) J801.2 R801.1 R801.2
N$17: C812.2 IC802.3(VCP) R808.1
N$18: C810.2 IC802.2(CP2)
N$19: C810.1 IC802.1(CP1)
N$20: IC802.6(I_SENS_A) R805.1
N$21: IC802.9(I_SENS_B) R806.1
N$38: IC802.13(B_VREF) J802.4 R802.3 R802.4
N$39: IC802.12(A_VREF) J802.2 R802.1 R802.2
Unconnected: IC801.18(!FAULT) IC802.18(!FAULT)

### Buses
MOTORCONTROL:MOTOR+[0..5],MOTOR-[0..5],MC_DIRECTION[0..5],MC_ON[0..5],MC_I0_[0..5],MC_I1_[0..5]

## Sheet 9 of 10
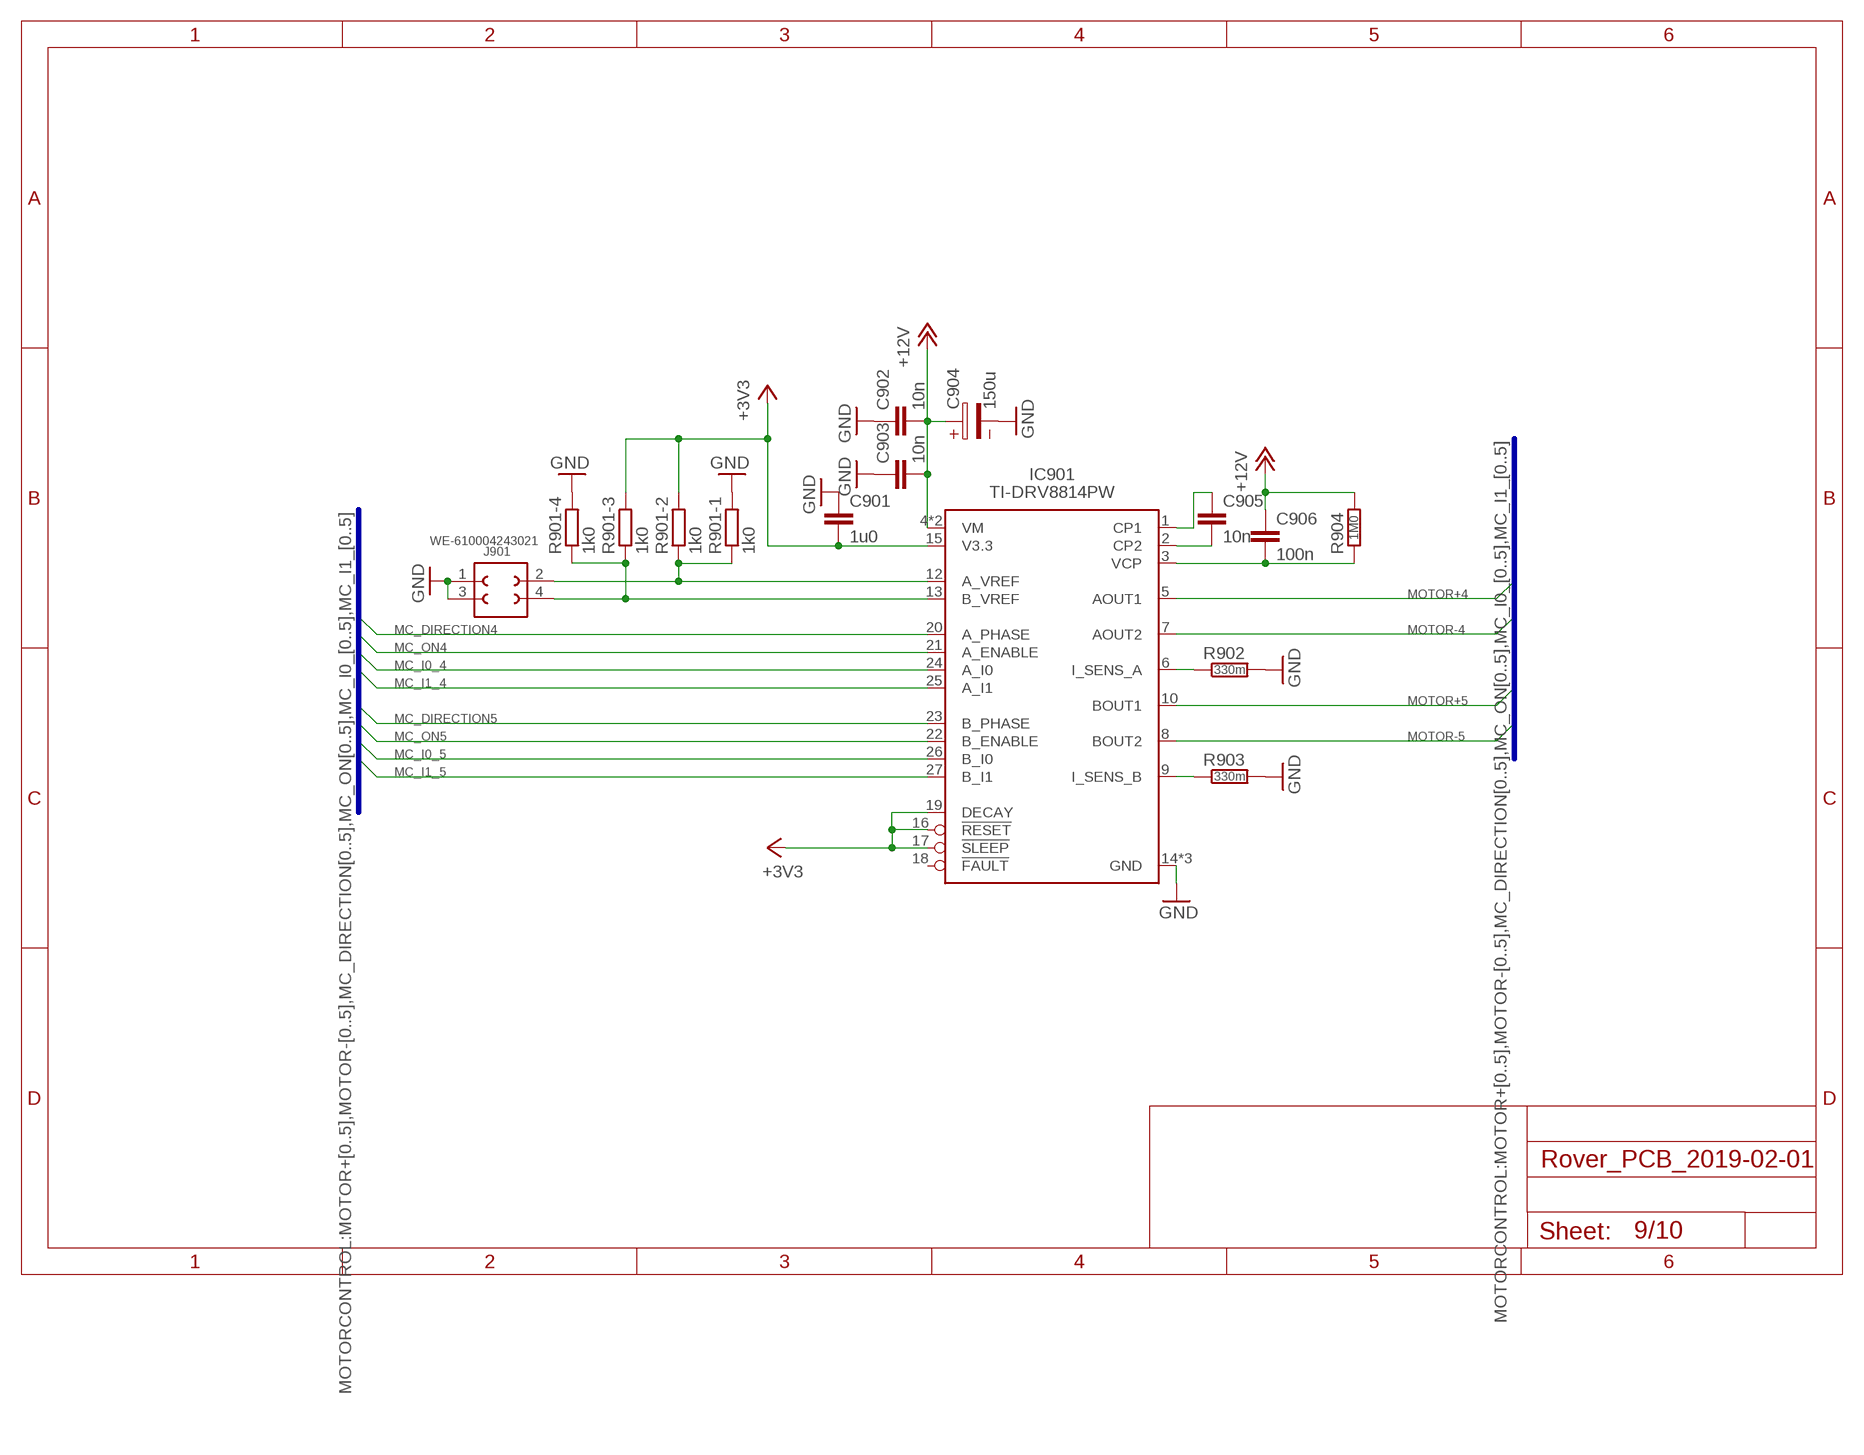
[diagram p8: schematic, sheet 9]

### Parts
C901  1u0  C-EUC0805N  [CAPC2012X95N]
C902  10n  C-EUC0805N  [CAPC2012X95N]
C903  10n  C-EUC0805N  [CAPC2012X95N]
C904  150u  WCAP-PSHP_8X8,7_875115452004  [4.2X1.9X2.8(BXCXA)]
C905  10n  C-EUC0805N  [CAPC2012X95N]
C906  100n  C-EUC0805N  [CAPC2012X95N]
IC901  TI-DRV8814PW  [SOP29P65_970X640X120L60X24T500X270N]
J901  WE-610004243021  610X04243021  [610X04243021]
R901  1k0  CTS-74,2C083  [CAPCAF80P160X320X70-8L]
R902  330m  R-EU-R0612L  [RESC160X320X65L50L]
R903  330m  R-EU-R0612L  [RESC160X320X65L50L]
R904  1M0  R-EU-R0805N  [RESC2012X50N]

### Nets
+3V3: C901.2 IC901.15(V3.3) IC901.16(!RESET) IC901.17(!SLEEP) IC901.19(DECAY) R901.6 R901.7 ; also sheet 4,5,7,8,10
+12V: C902.2 C903.2 C904.1 C906.1 IC901.4(VM) IC901.11(VM) R904.2 ; also sheet 1,8
GND: C901.1 C902.1 C903.1 C904.2 IC901.14(GND) IC901.28(GND) IC901.29(GND) J901.1 J901.3 R901.5 R901.8 R902.2 R903.2 ; also sheet 1,2,3,4,5,6,7,8,10
MC_DIRECTION4: IC901.20(A_PHASE) ; also sheet 7
MC_DIRECTION5: IC901.23(B_PHASE) ; also sheet 7
MC_I0_4: IC901.24(A_I0) ; also sheet 7
MC_I0_5: IC901.26(B_I0) ; also sheet 7
MC_I1_4: IC901.25(A_I1) ; also sheet 7
MC_I1_5: IC901.27(B_I1) ; also sheet 7
MC_ON4: IC901.21(A_ENABLE) ; also sheet 7
MC_ON5: IC901.22(B_ENABLE) ; also sheet 7
MOTOR+4: IC901.5(AOUT1) ; also sheet 7
MOTOR+5: IC901.10(BOUT1) ; also sheet 7
MOTOR-4: IC901.7(AOUT2) ; also sheet 7
MOTOR-5: IC901.8(BOUT2) ; also sheet 7
N$40: C906.2 IC901.3(VCP) R904.1
N$41: C905.2 IC901.2(CP2)
N$42: C905.1 IC901.1(CP1)
N$43: IC901.6(I_SENS_A) R902.1
N$44: IC901.9(I_SENS_B) R903.1
N$45: IC901.13(B_VREF) J901.4 R901.3 R901.4
N$46: IC901.12(A_VREF) J901.2 R901.1 R901.2
Unconnected: IC901.18(!FAULT)

### Buses
MOTORCONTROL:MOTOR+[0..5],MOTOR-[0..5],MC_DIRECTION[0..5],MC_ON[0..5],MC_I0_[0..5],MC_I1_[0..5]

## Sheet 10 of 10
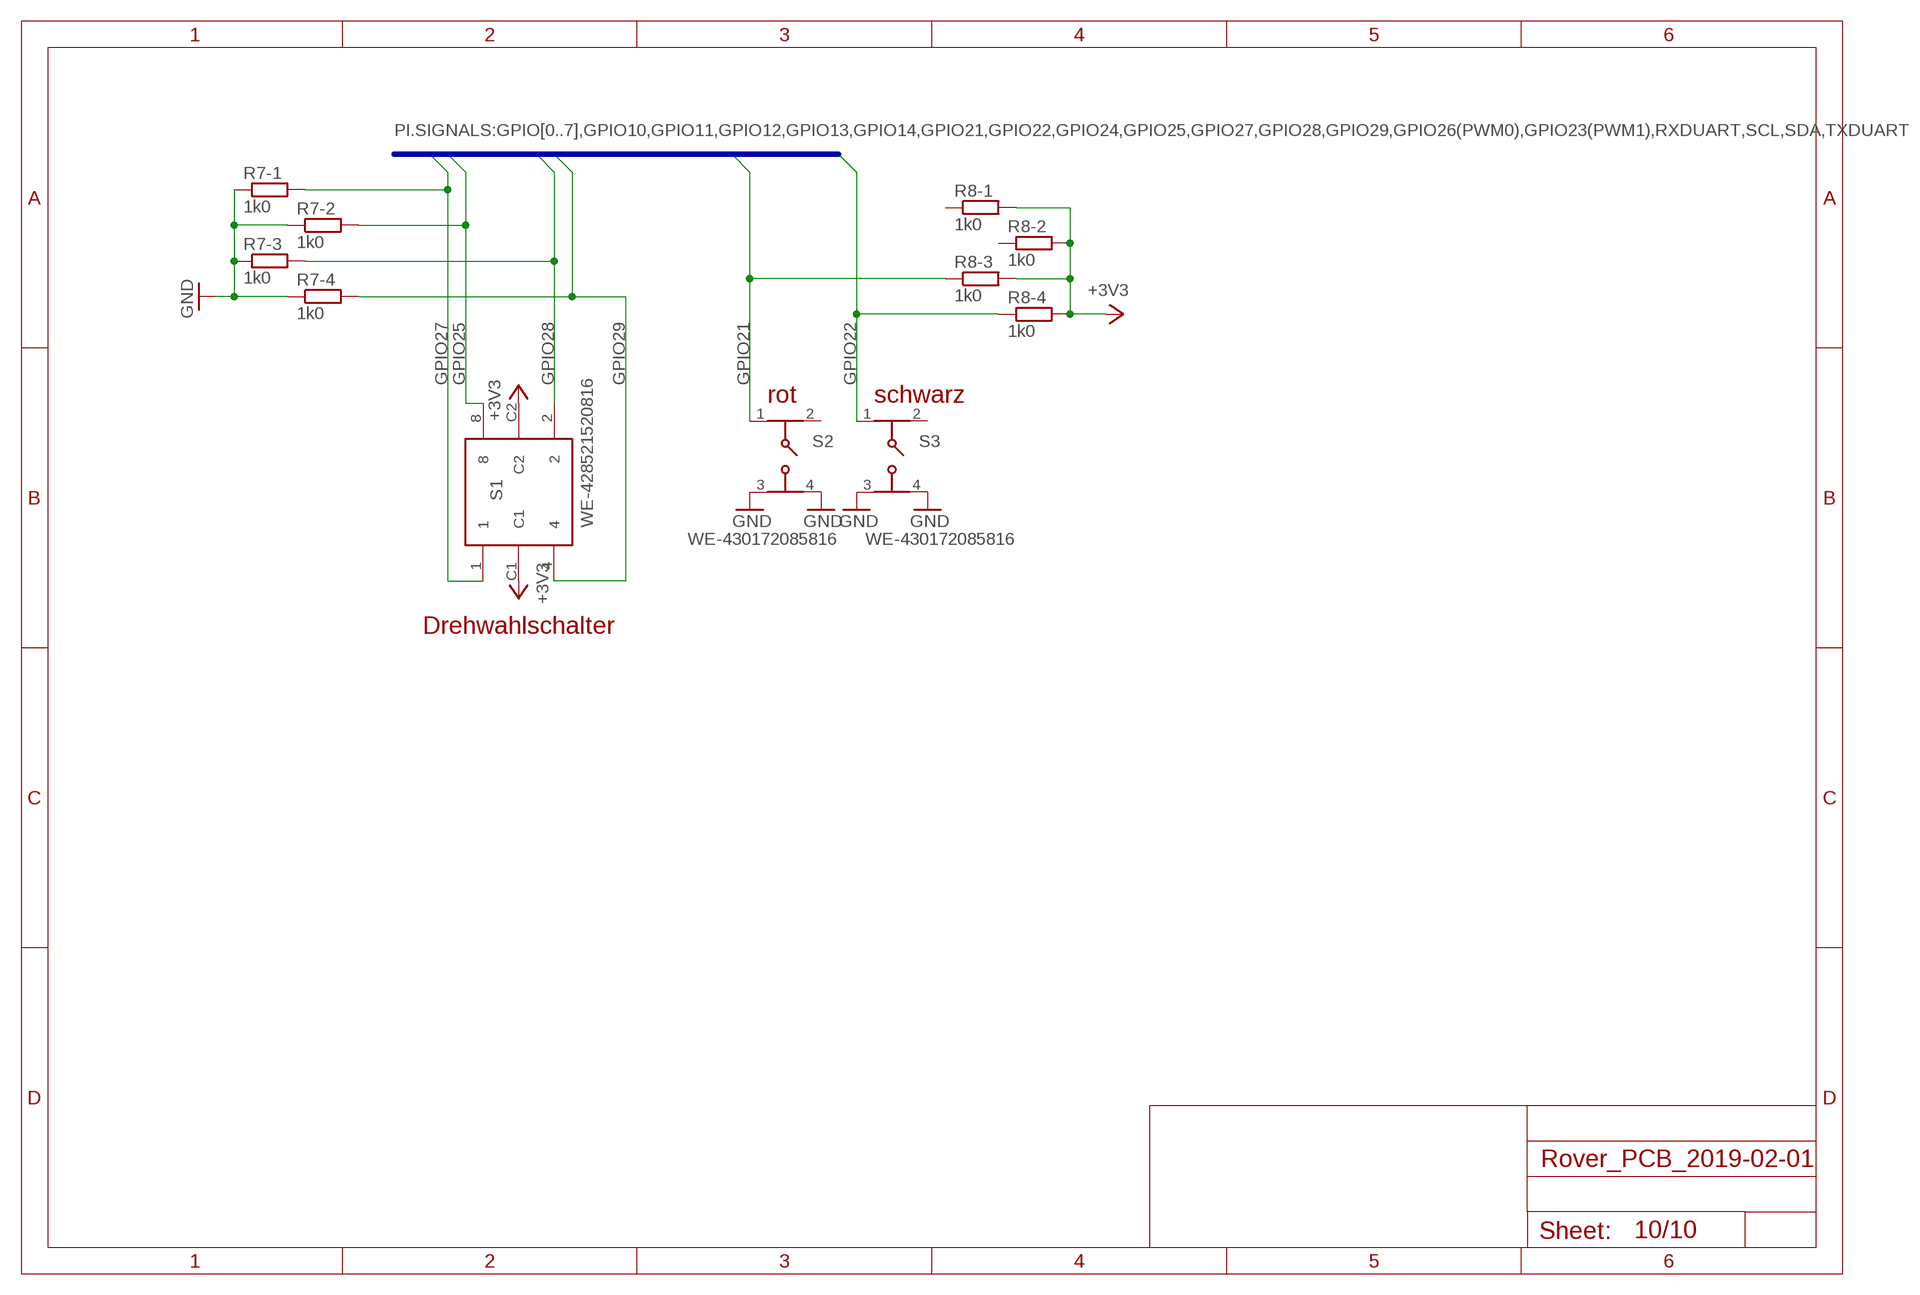
[diagram p9: schematic, sheet 10]

### Parts
R7  1k0  CTS-74,2C083  [CAPCAF80P160X320X70-8L]
R8  1k0  CTS-74,2C083  [CAPCAF80P160X320X70-8L]
S1  WE-428521520816  428521520816  [428521520816]
S2  WE-430172085816  430162043826  [4301X20438X6]
S3  WE-430172085816  430162043826  [4301X20438X6]

### Nets
+3V3: R8.5 R8.6 R8.7 R8.8 S1.C1 S1.C2 ; also sheet 4,5,7,8,9
GND: R7.1 R7.2 R7.3 R7.4 S2.3 S2.4 S3.3 S3.4 ; also sheet 1,2,3,4,5,6,7,8,9
GPIO21: R8.3 S2.1 ; also sheet 4
GPIO22: R8.4 S3.1 ; also sheet 4
GPIO25: R7.7 S1.8 ; also sheet 4
GPIO27: R7.8 S1.1 ; also sheet 4
GPIO28: R7.6 S1.2 ; also sheet 4
GPIO29: R7.5 S1.4 ; also sheet 4
Unconnected: R8.1 R8.2 S2.2 S3.2

### Buses
PI.SIGNALS:GPIO[0..7],GPIO10,GPIO11,GPIO12,GPIO13,GPIO14,GPIO21,GPIO22,GPIO24,GPIO25,GPIO27,GPIO28,GPIO29,GPIO26(PWM0),GPIO23(PWM1),RXDUART,SCL,SDA,TXDUART

### Notes on the sheet
- rot | schwarz
- Drehwahlschalter

## Library data of the parts
C101-C106 C401-C404 C701 C702 C801-C806 C809-C812 C901-C903 C905 C906 = Rover_bib:C-EU: Capacitor, European Symbol
C807 C808 C904 = Rover_bib:WCAP-PSHP: WCAP-PSHP Aluminum Polymer Capacitors Characteristics Aluminum Polymer Capacitor Recommended soldering: Reflow Operating temperature: -55 °C to +105 °C Miniaturized product series Low ESR at high frequency range High permissible ripple current Load life:2000 h @ +105 °C Package name and Variant abbreviation: Package: Package: B X C X A = length of the solder pad X width of the solder pad X pitch of the solder pad. Variant: D X L = Diameter of the body part X Height of the body part. <http://katalog.we-online.de/media/images/eisos/WCAP-PSHP_pf2.jpg> Details see: http://katalog.we-online.de/en/pbs/WCAP-PSHP?m Created: 2015-03-10 2015 (C) Wurth Elektronik; WE-NUMBER: 875115452004/150uF
IC301-IC304 = Rover_bib:TI-SN74LV4051A: SN74LV4051A 8-Channel Analog Multiplexer/Demultiplexer The SN74LV4051A 8-channel CMOS analog multiplexers and demultiplexers are designed for 2-V to 5.5-V VCC operation. The SN74LV4051A devices handle both analog and digital signals. Each channel permits signals with amplitudes up to 5.5-V (peak) to be transmitted in either direction. Applications include: signal gating, chopping, modulation or demodulation (modem), and signal multiplexing for analog-to-digital and digital-to-analog conversion systems.
IC401 = Testing:MPU-6050
IC701 IC702 = Rover_bib:PCA9555: 16-bit I2C and SMBus I/O port with interrupt Source: PCA9555_5.pdf; MPN: PCA9555PW; OC_FARNELL: 1408297; OC_NEWARK: 63K6069
IC703 IC704 = Rover_bib:74*32: Quad 2-input OR gate
IC801 IC802 IC901 = Rover_bib:TI-DRV8814
J1-J4 = Rover_bib:610X2021121: WR-PHD 2.54mm Dual SMT Pin Header, 20 Pins =>Code : Con_BTB_PHD_2.54_2_610x2021121(packageing:x = 0: Tube x = 3: Tape & Reel with Cap; 300 pcs/Reel) <http://katalog.we-online.de/media/images/eican/Con_BTB_PHD_2.54_2_6100xx21121_pf2.jpg> 6100xx21121 Details see: http://katalog.we-online.de/en/em/610_0xx_211_21 6103xx21121 Details see: http://katalog.we-online.de/en/em/PHD_2_54_SMT_DUAL_PIN_HEADER_REEL_6103XX21121 2014 (C) Würth Elektronik
J101 = Rover_bib:694108105102: WR-DC_DC Power Jack_Right Angled_SMT Center Pin Ø2.5_Plug ID Ø2.55_Plug OD Ø5.5_with Peg ;=>Code : Con_WR-DC_SMT_694106105102_694108105102 <http://katalog.we-online.de/media/images/v2/Family_WR-DC_DC_Power_Jack_Right_Angled_SMT_694106105102.jpg> Details see: http://katalog.we-online.de/em/datasheet/6941xx105102.pdf Created 2014-10-08, Karrer Zheng 2014 (C) Wurth Elektronik
J201 = Rover_bib:690367280476: WR-MM Female SMT Connector with Polarization, 4 Pins=>Code : Con_BTB_MM_Female_SMT_690367280476 <http://katalog.we-online.de/media/thumbs2/eican/thb_Con_BTB_MM_Female_SMT_69036728xx76_pf2.jpg> Details see: http://katalog.we-online.de/en/em/6903_6728_xx_76 Created 2014-06-04, Karrer Zheng 2014 (C) Würth Elektronik; MYNANE: Sensor00
J202 = Rover_bib:690367280476: WR-MM Female SMT Connector with Polarization, 4 Pins=>Code : Con_BTB_MM_Female_SMT_690367280476 <http://katalog.we-online.de/media/thumbs2/eican/thb_Con_BTB_MM_Female_SMT_69036728xx76_pf2.jpg> Details see: http://katalog.we-online.de/en/em/6903_6728_xx_76 Created 2014-06-04, Karrer Zheng 2014 (C) Würth Elektronik; MYNANE: Sensor15
J203 = Rover_bib:690367280476: WR-MM Female SMT Connector with Polarization, 4 Pins=>Code : Con_BTB_MM_Female_SMT_690367280476 <http://katalog.we-online.de/media/thumbs2/eican/thb_Con_BTB_MM_Female_SMT_69036728xx76_pf2.jpg> Details see: http://katalog.we-online.de/en/em/6903_6728_xx_76 Created 2014-06-04, Karrer Zheng 2014 (C) Würth Elektronik; MYNANE: Sensor01
J204 = Rover_bib:690367280476: WR-MM Female SMT Connector with Polarization, 4 Pins=>Code : Con_BTB_MM_Female_SMT_690367280476 <http://katalog.we-online.de/media/thumbs2/eican/thb_Con_BTB_MM_Female_SMT_69036728xx76_pf2.jpg> Details see: http://katalog.we-online.de/en/em/6903_6728_xx_76 Created 2014-06-04, Karrer Zheng 2014 (C) Würth Elektronik; MYNANE: Sensor14
J205 = Rover_bib:690367280476: WR-MM Female SMT Connector with Polarization, 4 Pins=>Code : Con_BTB_MM_Female_SMT_690367280476 <http://katalog.we-online.de/media/thumbs2/eican/thb_Con_BTB_MM_Female_SMT_69036728xx76_pf2.jpg> Details see: http://katalog.we-online.de/en/em/6903_6728_xx_76 Created 2014-06-04, Karrer Zheng 2014 (C) Würth Elektronik; MYNANE: Sensor02
J206 = Rover_bib:690367280476: WR-MM Female SMT Connector with Polarization, 4 Pins=>Code : Con_BTB_MM_Female_SMT_690367280476 <http://katalog.we-online.de/media/thumbs2/eican/thb_Con_BTB_MM_Female_SMT_69036728xx76_pf2.jpg> Details see: http://katalog.we-online.de/en/em/6903_6728_xx_76 Created 2014-06-04, Karrer Zheng 2014 (C) Würth Elektronik; MYNANE: Sensor13
J207 = Rover_bib:690367280476: WR-MM Female SMT Connector with Polarization, 4 Pins=>Code : Con_BTB_MM_Female_SMT_690367280476 <http://katalog.we-online.de/media/thumbs2/eican/thb_Con_BTB_MM_Female_SMT_69036728xx76_pf2.jpg> Details see: http://katalog.we-online.de/en/em/6903_6728_xx_76 Created 2014-06-04, Karrer Zheng 2014 (C) Würth Elektronik; MYNANE: Sensor03
J208 = Rover_bib:690367280476: WR-MM Female SMT Connector with Polarization, 4 Pins=>Code : Con_BTB_MM_Female_SMT_690367280476 <http://katalog.we-online.de/media/thumbs2/eican/thb_Con_BTB_MM_Female_SMT_69036728xx76_pf2.jpg> Details see: http://katalog.we-online.de/en/em/6903_6728_xx_76 Created 2014-06-04, Karrer Zheng 2014 (C) Würth Elektronik; MYNANE: Sensor12
J209 = Rover_bib:690367280476: WR-MM Female SMT Connector with Polarization, 4 Pins=>Code : Con_BTB_MM_Female_SMT_690367280476 <http://katalog.we-online.de/media/thumbs2/eican/thb_Con_BTB_MM_Female_SMT_69036728xx76_pf2.jpg> Details see: http://katalog.we-online.de/en/em/6903_6728_xx_76 Created 2014-06-04, Karrer Zheng 2014 (C) Würth Elektronik; MYNANE: Sensor04
J210 = Rover_bib:690367280476: WR-MM Female SMT Connector with Polarization, 4 Pins=>Code : Con_BTB_MM_Female_SMT_690367280476 <http://katalog.we-online.de/media/thumbs2/eican/thb_Con_BTB_MM_Female_SMT_69036728xx76_pf2.jpg> Details see: http://katalog.we-online.de/en/em/6903_6728_xx_76 Created 2014-06-04, Karrer Zheng 2014 (C) Würth Elektronik; MYNANE: Sensor11
J211 = Rover_bib:690367280476: WR-MM Female SMT Connector with Polarization, 4 Pins=>Code : Con_BTB_MM_Female_SMT_690367280476 <http://katalog.we-online.de/media/thumbs2/eican/thb_Con_BTB_MM_Female_SMT_69036728xx76_pf2.jpg> Details see: http://katalog.we-online.de/en/em/6903_6728_xx_76 Created 2014-06-04, Karrer Zheng 2014 (C) Würth Elektronik; MYNANE: Sensor05
J212 = Rover_bib:690367280476: WR-MM Female SMT Connector with Polarization, 4 Pins=>Code : Con_BTB_MM_Female_SMT_690367280476 <http://katalog.we-online.de/media/thumbs2/eican/thb_Con_BTB_MM_Female_SMT_69036728xx76_pf2.jpg> Details see: http://katalog.we-online.de/en/em/6903_6728_xx_76 Created 2014-06-04, Karrer Zheng 2014 (C) Würth Elektronik; MYNANE: Sensor10
J213 = Rover_bib:690367280476: WR-MM Female SMT Connector with Polarization, 4 Pins=>Code : Con_BTB_MM_Female_SMT_690367280476 <http://katalog.we-online.de/media/thumbs2/eican/thb_Con_BTB_MM_Female_SMT_69036728xx76_pf2.jpg> Details see: http://katalog.we-online.de/en/em/6903_6728_xx_76 Created 2014-06-04, Karrer Zheng 2014 (C) Würth Elektronik; MYNANE: Sensor06
J214 = Rover_bib:690367280476: WR-MM Female SMT Connector with Polarization, 4 Pins=>Code : Con_BTB_MM_Female_SMT_690367280476 <http://katalog.we-online.de/media/thumbs2/eican/thb_Con_BTB_MM_Female_SMT_69036728xx76_pf2.jpg> Details see: http://katalog.we-online.de/en/em/6903_6728_xx_76 Created 2014-06-04, Karrer Zheng 2014 (C) Würth Elektronik; MYNANE: Sensor09
J215 = Rover_bib:690367280476: WR-MM Female SMT Connector with Polarization, 4 Pins=>Code : Con_BTB_MM_Female_SMT_690367280476 <http://katalog.we-online.de/media/thumbs2/eican/thb_Con_BTB_MM_Female_SMT_69036728xx76_pf2.jpg> Details see: http://katalog.we-online.de/en/em/6903_6728_xx_76 Created 2014-06-04, Karrer Zheng 2014 (C) Würth Elektronik; MYNANE: Sensor07
J216 = Rover_bib:690367280476: WR-MM Female SMT Connector with Polarization, 4 Pins=>Code : Con_BTB_MM_Female_SMT_690367280476 <http://katalog.we-online.de/media/thumbs2/eican/thb_Con_BTB_MM_Female_SMT_69036728xx76_pf2.jpg> Details see: http://katalog.we-online.de/en/em/6903_6728_xx_76 Created 2014-06-04, Karrer Zheng 2014 (C) Würth Elektronik; MYNANE: Sensor08
J501 J502 J601 J602 = Rover_bib:610X20243021: WR-PHD 2.54mm SMT Dual Socket Header Bottom Entry, 20 Pins=>Code : Con_BTB_SHD_2.54_2_610x20243021(x = 0: Tube x = 3: Tape & Reel with Cap) <http://katalog.we-online.de/media/images/eican/Con_BTB_SHD_2.54_2_6100xx243021_pf2.jpg> Details see: 6100xx243021 http://katalog.we-online.de/en/em/PHD_2_54_SMT_DUAL_SOCKET_HEADER_BOTTOM_ENTRY_6100XX243021 6103xx243021 http://katalog.we-online.de/en/em/PHD_2_54_SMT_DUAL_SOCKET_HEADER_BOTTOM_ENTRY_6103XX243021 2014 (C) Würth Elektronik
J701 J702 = Rover_bib:691305140008: Serie 3051 - 3.50mm Horizontal PCB Header w. Plastic Latch WR-TBL KIND PROPERTIES: Standard Polarities 02;​03;​04;​05;​06;​07;​08;​12 Pitch 3.5 mm MATERIAL PROPERTIES: Insulator Material PA66 Insulator Color Green Insulator Flammability Rating UL94-V0 Contact Material Copper Alloy Contact Plating Tin GENERAL PROPERTIES: Operating Temperature -40 °C up to +105 °C Compliance Lead free / RoHS <http://katalog.we-online.de/media/images/v2/Family_WR-TBL3_6913051400xx.jpg> Details see: http://katalog.we-online.de/en/em/TBL_3_50_3051_HORIZONTAL_PCB_HEADER_6913051400xx/691305140012?m Created 2017-06-22, Yignchun,Shan 2017 (C) Würth Elektronik
J801 J802 J901 = Rover_bib:610X04243021: WR-PHD 2.54mm SMT Dual Socket Header Bottom Entry, 4 Pins=>Code : Con_BTB_SHD_2.54_2_610x04243021(packageing:x = 0: Tube x = 3: Tape & Reel with Cap) <http://katalog.we-online.de/media/images/eican/Con_BTB_SHD_2.54_2_6100xx243021_pf2.jpg> Details see: 6100xx243021 http://katalog.we-online.de/en/em/PHD_2_54_SMT_DUAL_SOCKET_HEADER_BOTTOM_ENTRY_6100XX243021 6103xx243021 http://katalog.we-online.de/en/em/PHD_2_54_SMT_DUAL_SOCKET_HEADER_BOTTOM_ENTRY_6103XX243021 2014 (C) Würth Elektronik
LED701-LED708 = Rover_bib:LED: LEDs Standard schematic elements and footprints for 5mm, 3mm, 1206, and 0603 sized LEDs. 5mm - Spark Fun Electronics SKU : COM-00529 (and others)
PIN401-PIN403 = Rover_bib:SOLDER_PIN: Simple Solder pin Created G. Klenner, 2013 (C) K&K Prime Engineering GmbH
R1 R2 R7 R8 R701-R704 R801 R802 R901 = Rover_bib:CTS-74: Chip Resistor Arrays Series 74x Features Low Cost Thick Film Technology High Density Packaging Low Profile; can be used in PCMCIA cards Leadless Surface Mount Construction Concave or Convex Terminations Solder Coated Nickel Barrier Pads Isolated and Bussed Circuits Resistor Arrays Require Fewer Placements Than Discrete Components Tape and Reel Packaging RoHS Compliant in Accordance with EU Directive 2005/95/EC View All Features in Datasheet <http://www.ctscorp.com/components/Datasheets/CTSChipArrayDs.pdf> Details see: www.ctscorp.com Created A. Bachmaier, K&K Prime Engineering GmbH (c) 2011; 0_HOUSING: 1206; 0_MANUF: CTS; 1_DISTR: Digi-Key; 1_PN: 742C083103JPCT-ND
R3-R6 R101-R103 R401 R402 R807 R808 R904 = Rover_bib:R-EU: Resistor, European Symbol; EIA: 0805
R803-R806 R902 R903 = Rover_bib:R-EU: Resistor, European Symbol
S1 = Rover_bib:428521520816: 10x10 mm washable SMD cross type WS-ROSV,16 position <http://katalog.we-online.de/media/images/v2/Family_WS-ROSV_SMD_Rotary_Switch_4285215208xx.jpg> Details see: http://katalog.we-online.de/en/em/ROSV_10X10_WASHABLE_SMD_CROSS_TYPE/428521520810 2015 (C) Würth Elektronik
S2 S3 = Rover_bib:430162043826: 12x12 mm SMD WS-TASV <http://katalog.we-online.de/media/images/v2/Family_WS-TASV-Gruppe.jpg> Details see: http://katalog.we-online.de/em/datasheet/4301x20438x6.pdf 2016 (C) Würth Elektronik
SJ401 = SparkFun:SOLDERJUMPER: Solder Jumper Standard SMD solder jumper. Used to automate production. Two varients : Normally Open and Normally Closed are the same, but have different paste layers. NC will have a large amount of paste and should jumper during reflow.
SJ402 = Rover_bib:SOLDERJUMPER: Solder Jumper Standard SMD solder jumper. Used to automate production. Two varients : Normally Open and Normally Closed are the same, but have different paste layers. NC will have a large amount of paste and should jumper during reflow.
SJ403 = Rover_bib:SOLDERJUMPER_2WAY: Solder Jumper 2 way solder jumper
U101 = Rover_bib:VDRM_171030601: MagI³C-VDRM Variable Step Down Regulator Module 6-42V / 3.0A / 0.8-6V Output <http://katalog.we-online.de/media/images/v2/MagIC_VDRM_pf2(3).jpg> Details see: http://katalog.we-online.de/pm/datasheet/171030601.pdf Created By Yingchun,Shan 2017-12-15 2017 (C) Wurth Elektronik

## Board
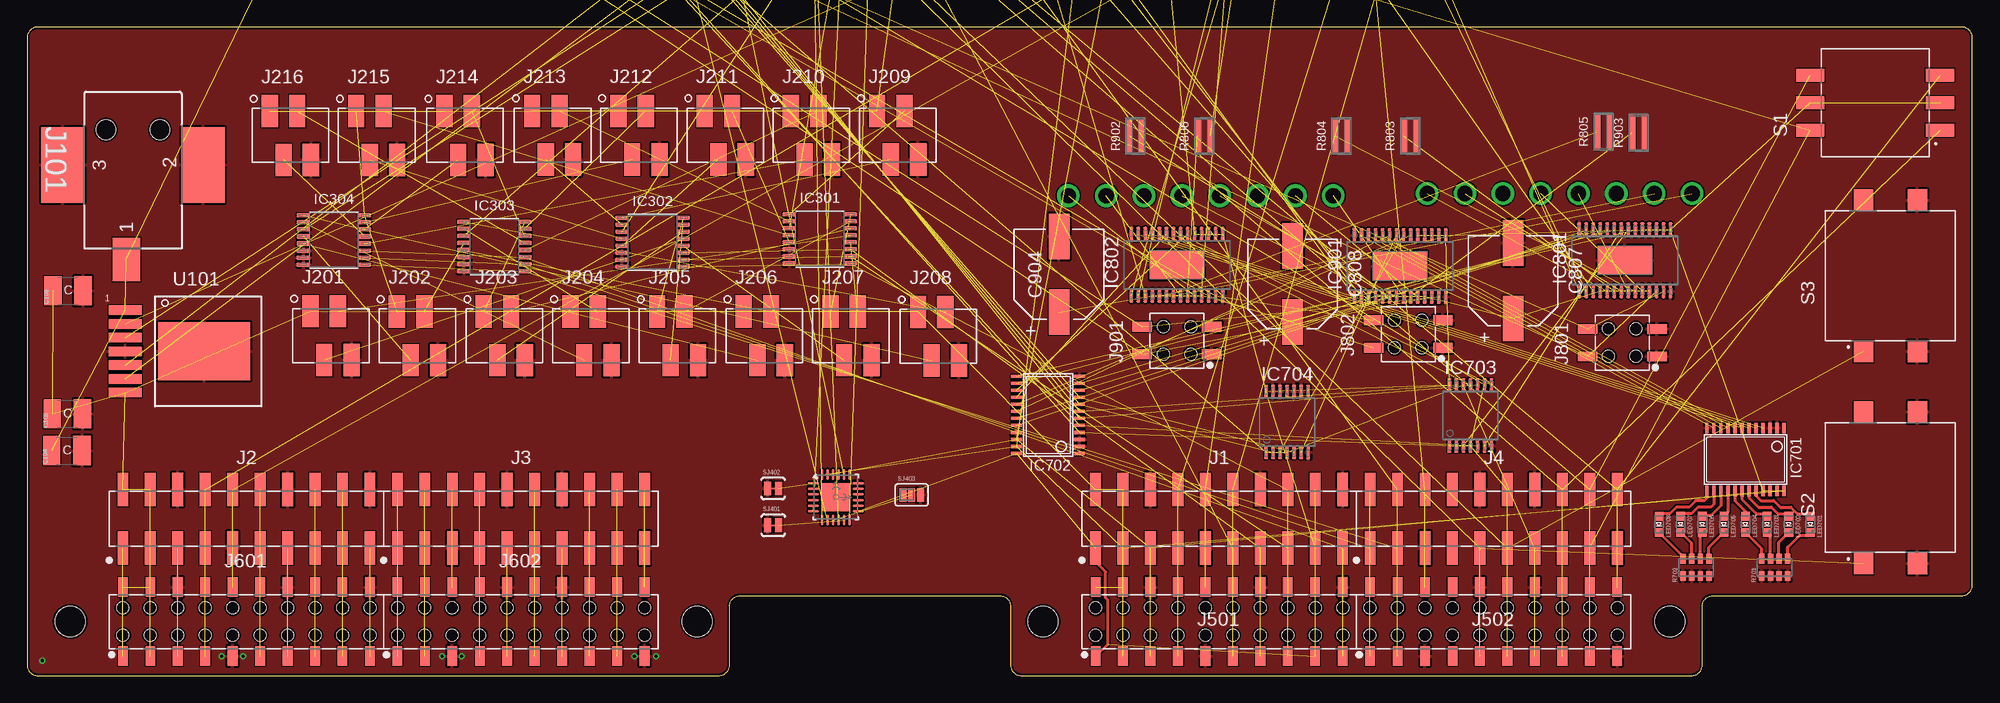
[diagram p10: board, top side]
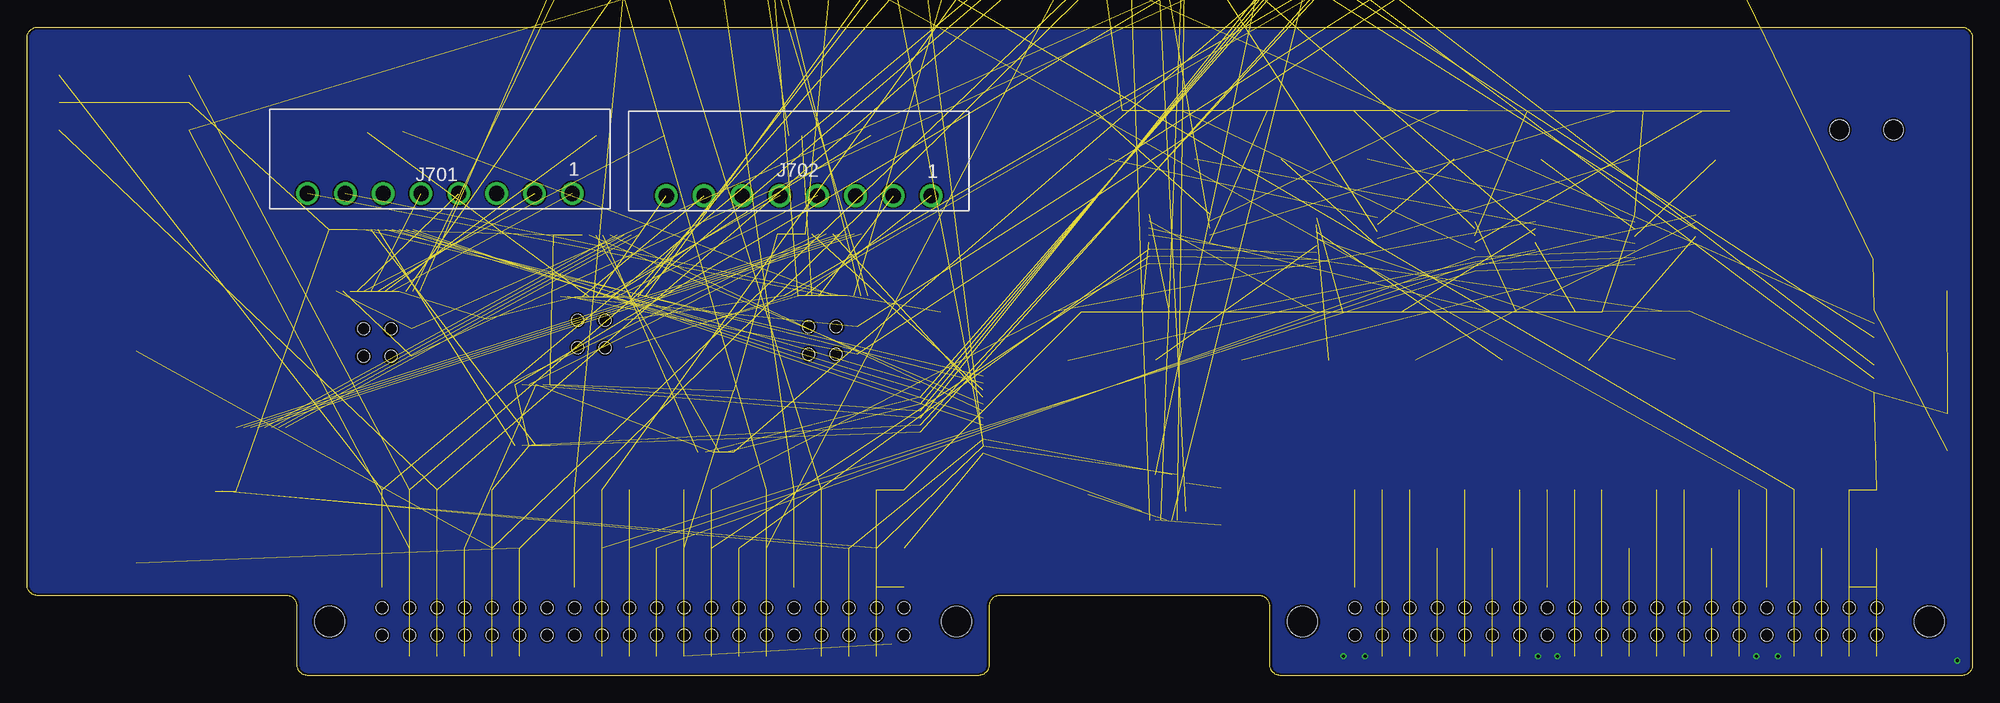
[diagram p11: board, bottom side, seen from below]

Size 180 x 60 mm. Coordinates in mm from the lower left corner, seen from the top.
Outline: 0,59 0,1 arc90 1,0 64,0 arc90 65,1 65,6.4 arc-90 66,7.4 90,7.4 arc-90 91,6.4 91,1 arc90 92,0 154,0 arc90 155,1 155,6.4 arc-90 156,7.4 179,7.4 arc90 180,8.4 180,59 arc90 179,60 1,60 arc90 0,59
Copper layers (1+2*3+16): Top 0.035mm / dielectric 0.36mm / Route2 0.035mm / dielectric 0.71mm / Route3 0.035mm / dielectric 0.36mm / Bottom 0.035mm
Design rules "Multi-CB_4L_125um-Tracks_OL35um-IL35um_KK": minimum track width 0.125mm, minimum drill 0.2mm, track to track 0.125mm, track to pad 0.125mm, pad to pad 0.125mm, via to via 0.125mm, smd to smd 0mil, copper to edge 0.2mm, drill to drill 0.2mm, minimum pad ring 0.125mm, minimum via ring 0.125mm, stop-mask expansion 2mil, vias tented up to drill 0.45mm, thermal gap 0.2mm
Holes 2.8 mm at 4,5 62,5 94,5 152,5

### Footprints (pad centres in the part's own frame; a part is rotated, then mirrored left to right if it is on the bottom)
CAPC2012X95N = smd 1.15 x 1.45: 1 0.9,0; 2 -0.9,0
CAP-US1210-EU3225 = smd 1.6 x 2.7: 1 -1.4,0; 2 1.4,0
4.2X1.9X2.8(BXCXA) = smd 4.2 x 1.9: 1 3.5,0; 2 -3.5,0
SOP16P65_500X640X120L62X24L = smd 1.27 x 0.37: 1 -2.82,2.275; 2 -2.82,1.625; 3 -2.82,0.975; 4 -2.82,0.325; 5 -2.82,-0.325; 6 -2.82,-0.975; 7 -2.82,-1.625; 8 -2.82,-2.275; 9 2.82,-2.275; 10 2.82,-1.625; 11 2.82,-0.975; 12 2.82,-0.325; 13 2.82,0.325; 14 2.82,0.975; 15 2.82,1.625; 16 2.82,2.275
QFN-24-4MM2 = smd 1.016 x 0.254: 1 -2.066,1.257; 2 -2.066,0.75; 3 -2.066,0.247; 4 -2.066,-0.287; 5 -2.066,-0.792; 6 -2.066,-1.297; 13 2.086,-1.297; 14 2.086,-0.792; 15 2.086,-0.287; 16 2.086,0.247; 17 2.086,0.75; 18 2.086,1.257 | smd 0.254 x 1.016: 7 -1.267,-2.122; 8 -0.762,-2.122; 9 -0.258,-2.122; 10 0.278,-2.122; 11 0.78,-2.122; 12 1.287,-2.122; 19 1.287,2.082; 20 0.78,2.082; 21 0.278,2.082; 22 -0.258,2.082; 23 -0.762,2.082; 24 -1.267,2.082 | smd 2.616 x 2.616: P$1 0.02,-0.01
TSSOP24 = smd 0.305 x 0.991: 1 -3.575,-2.918; 2 -2.925,-2.918; 3 -2.275,-2.918; 4 -1.625,-2.918; 5 -0.975,-2.918; 6 -0.325,-2.918; 7 0.325,-2.918; 8 0.975,-2.918; 9 1.625,-2.918; 10 2.275,-2.918; 11 2.925,-2.918; 12 3.575,-2.918; 13 3.575,2.918; 14 2.925,2.918; 15 2.275,2.918; 16 1.625,2.918; 17 0.975,2.918; 18 0.325,2.918; 19 -0.325,2.918; 20 -0.975,2.918; 21 -1.625,2.918; 22 -2.275,2.918; 23 -2.925,2.918; 24 -3.575,2.918
SOP14P65_500X640X120L62X24L = smd 0.37 x 1.27: 1 -1.95,-2.82; 2 -1.3,-2.82; 3 -0.65,-2.82; 4 0,-2.82; 5 0.65,-2.82; 6 1.3,-2.82; 7 1.95,-2.82; 8 1.95,2.82; 9 1.3,2.82; 10 0.65,2.82; 11 0,2.82; 12 -0.65,2.82; 13 -1.3,2.82; 14 -1.95,2.82
SOP29P65_970X640X120L60X24T500X270N = smd 0.39 x 1.34: 1 -4.225,-2.84; 2 -3.575,-2.84; 3 -2.925,-2.84; 4 -2.275,-2.84; 5 -1.625,-2.84; 6 -0.975,-2.84; 7 -0.325,-2.84; 8 0.325,-2.84; 9 0.975,-2.84; 10 1.625,-2.84; 11 2.275,-2.84; 12 2.925,-2.84; 13 3.575,-2.84; 14 4.225,-2.84; 15 4.225,2.84; 16 3.575,2.84; 17 2.925,2.84; 18 2.275,2.84; 19 1.625,2.84; 20 0.975,2.84; 21 0.325,2.84; 22 -0.325,2.84; 23 -0.975,2.84; 24 -1.625,2.84; 25 -2.275,2.84; 26 -2.925,2.84; 27 -3.575,2.84; 28 -4.225,2.84 | smd 5 x 2.7: 29 0,0
610X2021121 = smd 1 x 3.1: 1 -11.43,-2.7; 2 -11.43,2.7; 3 -8.89,-2.7; 4 -8.89,2.7; 5 -6.35,-2.7; 6 -6.35,2.7; 7 -3.81,-2.7; 8 -3.81,2.7; 9 -1.27,-2.7; 10 -1.27,2.7; 11 1.27,-2.7; 12 1.27,2.7; 13 3.81,-2.7; 14 3.81,2.7; 15 6.35,-2.7; 16 6.35,2.7; 17 8.89,-2.7; 18 8.89,2.7; 19 11.43,-2.7; 20 11.43,2.7
69410X105102 = smd 4 x 2.5: 1 15.5,-0.6 | smd 7 x 4: 2 6.75,6.5; 3 6.75,-6.5 | hole 1.8: 3.5,2.5; 3.5,-2.5
690367280476 = smd 1.5 x 3: 1 -1.905,2.25; 2 -0.635,-2.25; 3 0.635,2.25; 4 1.905,-2.25
610X20243021 = smd 0.9 x 1.8: 1 -11.43,-3.2; 2 -11.43,3.2; 3 -8.89,-3.2; 4 -8.89,3.2; 5 -6.35,-3.2; 6 -6.35,3.2; 7 -3.81,-3.2; 8 -3.81,3.2; 9 -1.27,-3.2; 10 -1.27,3.2; 11 1.27,-3.2; 12 1.27,3.2; 13 3.81,-3.2; 14 3.81,3.2; 15 6.35,-3.2; 16 6.35,3.2; 17 8.89,-3.2; 18 8.89,3.2; 19 11.43,-3.2; 20 11.43,3.2 | hole 1.1: -11.43,1.27; -8.89,1.27; -8.89,-1.27; -11.43,-1.27; -6.35,1.27; -6.35,-1.27; -3.81,1.27; -3.81,-1.27; -1.27,-1.27; -1.27,1.27; 1.27,1.27; 1.27,-1.27; 3.81,-1.27; 3.81,1.27; 6.35,1.27; 6.35,-1.27; 8.89,1.27; 8.89,-1.27; 11.43,1.27; 11.43,-1.27
691305140008 = drill 1.4: 1 -12.25,0; 2 -8.75,0; 3 -5.25,0; 4 -1.75,0; 5 1.75,0; 6 5.25,0; 7 8.75,0; 8 12.25,0
610X04243021 = smd 0.9 x 1.8: 1 -1.27,-3.2; 2 -1.27,3.2; 3 1.27,-3.2; 4 1.27,3.2 | hole 1.1: -1.27,1.27; 1.27,1.27; 1.27,-1.27; -1.27,-1.27
LED-0603 = smd 0.8 x 0.8: A 0,-0.75; C 0,0.75
SOLDER_PIN_0.5 = drill 0.5: _ 0,0
CAPCAF80P160X320X70-8L = smd 0.5 x 0.9: 1 -1.2,-0.8; 2 -0.4,-0.8; 3 0.4,-0.8; 4 1.2,-0.8; 5 1.2,0.8; 6 0.4,0.8; 7 -0.4,0.8; 8 -1.2,0.8
RESC2012X50N = smd 0.95 x 1.45: 1 -1,0; 2 1,0
RESC160X320X65L50L = smd 0.6 x 3.4: 1 -0.6,0; 2 0.6,0
428521520816 = smd 1.2 x 2.6: 1 -2.54,-6; 2 2.54,6; 4 2.54,-6; 8 -2.54,6; C1 0,-6; C2 0,6
4301X20438X6 = smd 2 x 1.8: 1 -7,2.5; 2 7,2.5; 3 -7,-2.5; 4 7,-2.5
SJ_2S-TRACE = smd 0.635 x 1.27: 1 -0.508,0; 2 0.508,0
SJ_3_PASTE1&2 = smd 0.635 x 1.27: 1 -0.813,0; 2 0,0; 3 0.813,0
VDRM_7PIN-PFM = smd 3.06 x 0.89: 1 -7.305,3.81; 2 -7.305,2.54; 3 -7.305,1.27; 4 -7.305,0; 5 -7.305,-1.27; 6 -7.305,-2.54; 7 -7.305,-3.81 | smd 8.54 x 5.35: EP 0,0

### Placement (x,y rotation side)
C101  86.83,81.42 0 top  (outside the outline)
C102  81.75,81.42 0 top  (outside the outline)
C103  76.67,81.42 0 top  (outside the outline)
C104  3.69,20.82 0 top
C105  3.74,24.22 0 top
C106  3.79,35.62 0 top
C401  71.59,81.42 0 top  (outside the outline)
C402  66.51,81.42 0 top  (outside the outline)
C403  61.43,81.42 0 top  (outside the outline)
C404  56.35,81.42 0 top  (outside the outline)
C701  51.27,81.42 0 top  (outside the outline)
C702  46.19,81.42 0 top  (outside the outline)
C801  41.11,81.42 0 top  (outside the outline)
C802  36.03,81.42 0 top  (outside the outline)
C803  30.95,81.42 0 top  (outside the outline)
C804  136.36,85.23 0 top  (outside the outline)
C805  131.28,85.23 0 top  (outside the outline)
C806  126.2,85.23 0 top  (outside the outline)
C807  137.49,36.53 270 top
C808  117.09,36.23 270 top
C809  121.12,85.23 0 top  (outside the outline)
C810  116.04,85.23 0 top  (outside the outline)
C811  110.96,85.23 0 top  (outside the outline)
C812  105.88,85.23 0 top  (outside the outline)
C901  100.8,85.23 0 top  (outside the outline)
C902  95.72,85.23 0 top  (outside the outline)
C903  90.64,85.23 0 top  (outside the outline)
C904  95.49,37.13 270 top
C905  85.56,85.23 0 top  (outside the outline)
C906  80.48,85.23 0 top  (outside the outline)
IC301  73.36,40.4 0 top
IC302  57.88,40.1 0 top
IC303  43.24,39.7 0 top
IC304  28.4,40.3 0 top
IC401  74.82,16.52 0 top
IC701  159,20 180 top
IC702  94.47,24.13 90 top
IC703  133.55,24.07 0 top
IC704  116.59,23.47 0 top
IC801  147.83,38.42 0 top
IC802  106.4,38 0 top
IC901  127.04,37.89 0 top
J1  110.3,14.5 0 top
J2  20.3,14.5 0 top
J3  45.7,14.5 0 top
J4  135.7,14.5 0 top
J101  9.8,54 270 top
J201  28.12,31.46 0 top
J202  36.13,31.43 0 top
J203  44.15,31.43 0 top
J204  52.17,31.43 0 top
J205  60.19,31.43 0 top
J206  68.21,31.43 0 top
J207  76.23,31.43 0 top
J208  84.33,31.4 0 top
J209  80.55,50 0 top
J210  72.57,50 0 top
J211  64.59,50 0 top
J212  56.61,50 0 top
J213  48.63,50 0 top
J214  40.53,49.97 0 top
J215  32.35,49.97 0 top
J216  24.37,49.97 0 top
J501  110.3,5 0 top
J502  135.7,5 0 top
J601  20.3,5 0 top
J602  45.7,5 0 top
J701  141.8,44.6 180 bottom
J702  108.6,44.4 180 bottom
J801  147.6,30.8 90 top
J802  127.8,31.6 90 top
J901  106.4,31 90 top
LED701  165,14 180 top
LED702  163,14 180 top
LED703  161,14 180 top
LED704  159,14 180 top
LED705  157,14 180 top
LED706  155,14 180 top
LED707  153,14 180 top
LED708  151,14 180 top
PIN401  77.94,67.45 0 top  (outside the outline)
PIN402  75.4,67.45 0 top  (outside the outline)
PIN403  72.86,67.45 0 top  (outside the outline)
R1  83.02,77.61 0 top  (outside the outline)
R2  77.94,77.61 0 top  (outside the outline)
R3  130.01,77.61 0 top  (outside the outline)
R4  126.2,77.61 0 top  (outside the outline)
R5  122.39,77.61 0 top  (outside the outline)
R6  118.58,77.61 0 top  (outside the outline)
R7  72.86,77.61 0 top  (outside the outline)
R8  67.78,77.61 0 top  (outside the outline)
R101  114.77,77.61 0 top  (outside the outline)
R102  110.96,77.61 0 top  (outside the outline)
R103  107.15,77.61 0 top  (outside the outline)
R401  103.34,77.61 0 top  (outside the outline)
R402  99.53,77.61 0 top  (outside the outline)
R701  161.7,10.01 0 top
R702  154.42,10.01 0 top
R703  52.54,77.61 0 top  (outside the outline)
R704  47.46,77.61 0 top  (outside the outline)
R801  42.38,77.61 0 top  (outside the outline)
R802  37.3,77.61 0 top  (outside the outline)
R803  127.95,49.92 0 top
R804  121.6,49.92 0 top
R805  145.85,50.32 0 top
R806  108.9,49.92 0 top
R807  95.72,77.61 0 top  (outside the outline)
R808  91.91,77.61 0 top  (outside the outline)
R901  32.22,77.61 0 top  (outside the outline)
R902  102.55,49.92 0 top
R903  149.09,50.21 0 top
R904  88.1,77.61 0 top  (outside the outline)
S1  171,53 90 top
S2  172.4,17.4 90 top
S3  172.4,37 90 top
SJ401  69.04,13.92 0 top
SJ402  69.03,17.32 0 top
SJ403  81.85,16.72 0 top
U101  16.4,30 0 top

### Tracks (layer width: path | path; a pad name or v marks a point on that pad's centre or on a via)
+3V3  (41 unrouted)
  Top 0.3: J501.1 100,2.93 100,7 99.8,7.2 99.8,9.6 98.87,10.53 J1.1
+5V  (32 unrouted)
+12V  (24 unrouted)
ADO  (1 unrouted)
CLKIN  (1 unrouted)
FSYNC  (1 unrouted)
GND  (via drill 0.3)  (38 unrouted)
  other vias: 1.4,1.4 18,1.8 20,1.8 38.4,1.8 40.2,1.8 56.2,1.8 58.2,1.8
  pour Top: 0,0 0,60 180,60 180,0
  pour Bottom: 0,0 0,60 180,60 180,0
GPIO0  (3 unrouted)
GPIO1  (3 unrouted)
GPIO2  (3 unrouted)
GPIO3  (3 unrouted)
GPIO4  (3 unrouted)
GPIO5  (1 unrouted)
GPIO6  (1 unrouted)
GPIO7  (1 unrouted)
GPIO10  (3 unrouted)
GPIO11  (3 unrouted)
GPIO12  (3 unrouted)
GPIO13  (3 unrouted)
GPIO14  (3 unrouted)
GPIO21  (3 unrouted)
GPIO22  (3 unrouted)
GPIO23(PWM1)  (5 unrouted)
GPIO24  (1 unrouted)
GPIO25  (3 unrouted)
GPIO26(PWM0)  (5 unrouted)
GPIO27  (3 unrouted)
GPIO28  (3 unrouted)
GPIO29  (3 unrouted)
INT  (1 unrouted)
MC_DIRECTION0  (1 unrouted)
MC_DIRECTION1  (1 unrouted)
MC_DIRECTION2  (1 unrouted)
MC_DIRECTION3  (1 unrouted)
MC_DIRECTION4  (1 unrouted)
MC_DIRECTION5  (1 unrouted)
MC_I0_0  (1 unrouted)
MC_I0_1  (1 unrouted)
MC_I0_2  (1 unrouted)
MC_I0_3  (1 unrouted)
MC_I0_4  (1 unrouted)
MC_I0_5  (1 unrouted)
MC_I1_0  (1 unrouted)
MC_I1_1  (1 unrouted)
MC_I1_2  (1 unrouted)
MC_I1_3  (1 unrouted)
MC_I1_4  (1 unrouted)
MC_I1_5  (1 unrouted)
MC_ON0  (1 unrouted)
MC_ON1  (1 unrouted)
MC_ON2  (1 unrouted)
MC_ON3  (1 unrouted)
MC_ON4  (1 unrouted)
MC_ON5  (1 unrouted)
MC_ON/OFF0  (2 unrouted)
MC_ON/OFF1  (2 unrouted)
MC_ON/OFF2  (2 unrouted)
MC_ON/OFF3  (2 unrouted)
MC_ON/OFF4  (2 unrouted)
MC_ON/OFF5  (2 unrouted)
MOTOR+0  (1 unrouted)
MOTOR+1  (1 unrouted)
MOTOR+2  (1 unrouted)
MOTOR+3  (1 unrouted)
MOTOR+4  (1 unrouted)
MOTOR+5  (1 unrouted)
MOTOR-0  (1 unrouted)
MOTOR-1  (1 unrouted)
MOTOR-2  (1 unrouted)
MOTOR-3  (1 unrouted)
MOTOR-4  (1 unrouted)
MOTOR-5  (1 unrouted)
N$1  (1 unrouted)
N$2  (1 unrouted)
N$3  (1 unrouted)
N$4  (1 unrouted)
N$5  (1 unrouted)
N$6  (1 unrouted)
N$7  (3 unrouted)
N$8  (1 unrouted)
N$9  (1 unrouted)
N$10  (2 unrouted)
N$11  (1 unrouted)
N$12  (1 unrouted)
N$13  (1 unrouted)
N$14  (1 unrouted)
N$15  (3 unrouted)
N$16  (3 unrouted)
N$17  (2 unrouted)
N$18  (1 unrouted)
N$19  (1 unrouted)
N$20  (1 unrouted)
N$21  (1 unrouted)
N$22
  Top 0.3: R702.8 153.22,11.03 LED708.C
N$23
  Top 0.3: R702.7 154.02,12.23 LED707.C
N$24
  Top 0.3: R702.6 154.82,13.07 LED706.C
N$25
  Top 0.3: R702.5 155.62,11.87 LED705.C
N$26
  Top 0.3: R701.8 160.5,11.75 LED704.C
N$27
  Top 0.3: R701.7 161.3,12.95 LED703.C
N$28
  Top 0.3: R701.6 162.1,12.35 LED702.C
N$29
  Top 0.3: R701.5 162.9,11.9 164,13 164.75,13 LED701.C
N$30
  Top 0.3: IC701.13 155.43,16.43 155.2,16.2 154.4,16.2 153.8,15.6 152.6,15.6 152,15 151.25,15 LED708.A
N$31
  Top 0.3: IC701.14 156.07,15.88 155.8,15.6 154.6,15.6 154,15 153.25,15 LED707.A
N$32
  Top 0.3: IC701.15 156.72,15.72 155.8,14.8 155.05,14.8 LED706.A
N$33
  Top 0.3: IC701.16 157.38,15.12 LED705.A
N$34
  Top 0.3: IC701.17 158.03,16.18 159,15.2 LED704.A
N$35
  Top 0.3: IC701.18 158.68,16.32 160,15 160.75,15 LED703.A
N$36
  Top 0.3: IC701.19 159.32,16.48 160.2,15.6 161.4,15.6 162,15 162.75,15 LED702.A
N$37
  Top 0.3: IC701.20 159.97,16.62 160.4,16.2 161.6,16.2 162.2,15.6 163.2,15.6 163.8,15 164.75,15 LED701.A
N$38  (3 unrouted)
N$39  (3 unrouted)
N$40  (2 unrouted)
N$41  (1 unrouted)
N$42  (1 unrouted)
N$43  (1 unrouted)
N$44  (1 unrouted)
N$45  (3 unrouted)
N$46  (3 unrouted)
N$47  (1 unrouted)
N$48  (1 unrouted)
N$49  (1 unrouted)
N$50  (1 unrouted)
N$51  (1 unrouted)
N$52  (1 unrouted)
N$53  (1 unrouted)
N$54  (1 unrouted)
N$55  (1 unrouted)
N$56  (1 unrouted)
N$57  (1 unrouted)
N$58  (1 unrouted)
N$59  (1 unrouted)
N$60  (1 unrouted)
N$61  (1 unrouted)
N$62  (1 unrouted)
N$63  (1 unrouted)
N$64  (1 unrouted)
N$65  (1 unrouted)
N$66  (1 unrouted)
N$67  (1 unrouted)
N$68  (1 unrouted)
N$69  (1 unrouted)
N$70  (1 unrouted)
N$71  (1 unrouted)
N$72  (1 unrouted)
N$73  (1 unrouted)
N$74  (1 unrouted)
N$75  (2 unrouted)
N$76  (2 unrouted)
N$79  (1 unrouted)
N$80  (1 unrouted)
N$81  (1 unrouted)
RXDUART  (2 unrouted)
RXPI2  (2 unrouted)
SCL  (5 unrouted)
SDA  (5 unrouted)
SENSOR_IN0  (1 unrouted)
SENSOR_IN1  (1 unrouted)
SENSOR_IN2  (1 unrouted)
SENSOR_IN3  (1 unrouted)
SENSOR_IN4  (1 unrouted)
SENSOR_IN5  (1 unrouted)
SENSOR_IN6  (1 unrouted)
SENSOR_IN7  (1 unrouted)
SENSOR_IN8  (1 unrouted)
SENSOR_IN9  (1 unrouted)
SENSOR_IN10  (1 unrouted)
SENSOR_IN11  (1 unrouted)
SENSOR_IN12  (1 unrouted)
SENSOR_IN13  (1 unrouted)
SENSOR_IN14  (1 unrouted)
SENSOR_IN15  (1 unrouted)
SENSOR_OUT0  (1 unrouted)
SENSOR_OUT1  (1 unrouted)
SENSOR_OUT2  (1 unrouted)
SENSOR_OUT3  (1 unrouted)
SENSOR_OUT4  (1 unrouted)
SENSOR_OUT5  (1 unrouted)
SENSOR_OUT6  (1 unrouted)
SENSOR_OUT7  (1 unrouted)
SENSOR_OUT8  (1 unrouted)
SENSOR_OUT9  (1 unrouted)
SENSOR_OUT10  (1 unrouted)
SENSOR_OUT11  (1 unrouted)
SENSOR_OUT12  (1 unrouted)
SENSOR_OUT13  (1 unrouted)
SENSOR_OUT14  (1 unrouted)
SENSOR_OUT15  (1 unrouted)
TXDUART  (2 unrouted)
TXPI2  (2 unrouted)
VIO  (1 unrouted)